# Altium project PCB_Project.PrjPcb (part 1 of 2)
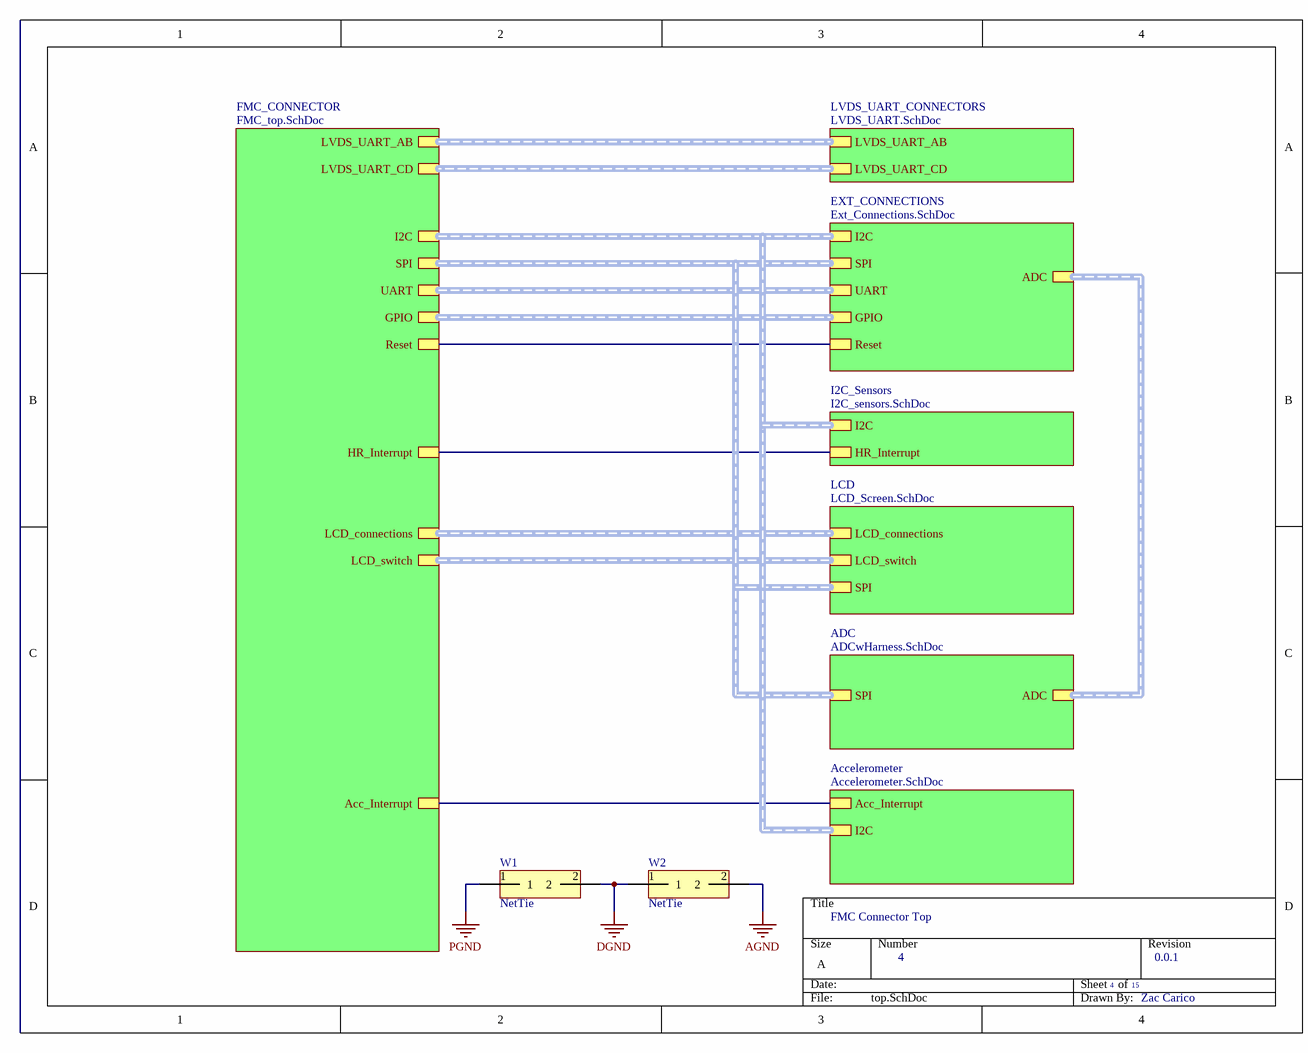
[diagram p0: top.SchDoc]
15 sheets, 131 parts. Net scope: hierarchical (ports join the sheet entries above them; power ports are global).
Board file: PCB1.PcbDoc
Sheets:
  top.SchDoc
    FMC_CONNECTOR = FMC_top.SchDoc
      FMC_AB = FMC_connector_AB.SchDoc
      FMC_CD = FMC_connector_CD.SchDoc
      FMC_EF = FMC_connector_EF.SchDoc
      FMC_GH = FMC_connector_GH.SchDoc
      FMC_JK = FMC_connector_JK.SchDoc
    LVDS_UART_CONNECTORS = LVDS_UART.SchDoc
    EXT_CONNECTIONS = Ext_connections.SchDoc
      Designator = GPIO_SW.SchDoc
      Designator = GPIO_LED.SchDoc
    I2C_Sensors = I2C_sensors.SchDoc
    LCD = LCD_Screen.SchDoc
    ADC = ADCwHarness.SchDoc
    Accelerometer = Accelerometer.SchDoc

## Sheet top.SchDoc: FMC Connector Top
size A; Author: Zac Carico; CompanyName: BYUI; DrawnBy: Zac Carico; Engineer: Zac Carico; Organization: CSEE; DocumentNumber: 4; Revision: 0.0.1; SheetNumber: 4; SheetTotal: 15

### Parts
W1  NetTie  [NetTie]  (net tie, no BOM)
W2  NetTie  [NetTie]  (net tie, no BOM)

### Sub-sheets
Accelerometer = Accelerometer.SchDoc: Acc_Interrupt, I2C (harness I2C)
ADC = ADCwHarness.SchDoc: ADC (harness ADC), SPI (harness SPI)
EXT_CONNECTIONS = Ext_Connections.SchDoc: I2C (harness I2C), SPI (harness SPI), UART (harness UART), GPIO (harness GPIO), ADC (harness ADC), Reset
FMC_CONNECTOR = FMC_top.SchDoc: GPIO (harness GPIO), UART (harness UART), I2C (harness I2C), SPI (harness SPI), LCD_connections (harness LCD_connections), LCD_switch (harness LCD_switch), Acc_Interrupt, LVDS_UART_AB (harness LVDS_UART_AB), LVDS_UART_CD (harness LVDS_UART_CD), Reset, HR_Interrupt
I2C_Sensors = I2C_sensors.SchDoc: I2C (harness I2C), HR_Interrupt
LCD = LCD_Screen.SchDoc: LCD_connections (harness LCD_connections), LCD_switch (harness LCD_switch), SPI (harness SPI)
LVDS_UART_CONNECTORS = LVDS_UART.SchDoc: LVDS_UART_CD (harness LVDS_UART_CD), LVDS_UART_AB (harness LVDS_UART_AB)

### Nets
AGND: W2.2
DGND: W1.2 W2.1
PGND: W1.1
NetJ1_F19: sheet FMC_CONNECTOR/Acc_Interrupt, sheet Accelerometer/Acc_Interrupt
NetJ1_F20: sheet FMC_CONNECTOR/Reset, sheet EXT_CONNECTIONS/Reset
NetJ1_F37: sheet FMC_CONNECTOR/HR_Interrupt, sheet I2C_Sensors/HR_Interrupt

### Buses and harness runs
harness sheet Accelerometer/I2C = sheet EXT_CONNECTIONS/I2C = sheet FMC_CONNECTOR/I2C = sheet I2C_Sensors/I2C
harness sheet ADC/ADC = sheet EXT_CONNECTIONS/ADC
harness sheet ADC/SPI = sheet EXT_CONNECTIONS/SPI = sheet FMC_CONNECTOR/LCD_switch = sheet FMC_CONNECTOR/SPI = sheet LCD/LCD_switch = sheet LCD/SPI
harness sheet EXT_CONNECTIONS/GPIO = sheet FMC_CONNECTOR/GPIO
harness sheet EXT_CONNECTIONS/UART = sheet FMC_CONNECTOR/UART
harness sheet FMC_CONNECTOR/LCD_connections = sheet LCD/LCD_connections
harness sheet FMC_CONNECTOR/LVDS_UART_AB = sheet LVDS_UART_CONNECTORS/LVDS_UART_AB
harness sheet FMC_CONNECTOR/LVDS_UART_CD = sheet LVDS_UART_CONNECTORS/LVDS_UART_CD

## Sheet FMC_top.SchDoc: FMC Connector Top
size A; Author: James Thomas; CompanyName: BYUI; DrawnBy: James Thomas; Engineer: James Thomas; Organization: CSEE; DocumentNumber: 8; Revision: 0.0.1; SheetNumber: 8; SheetTotal: 15
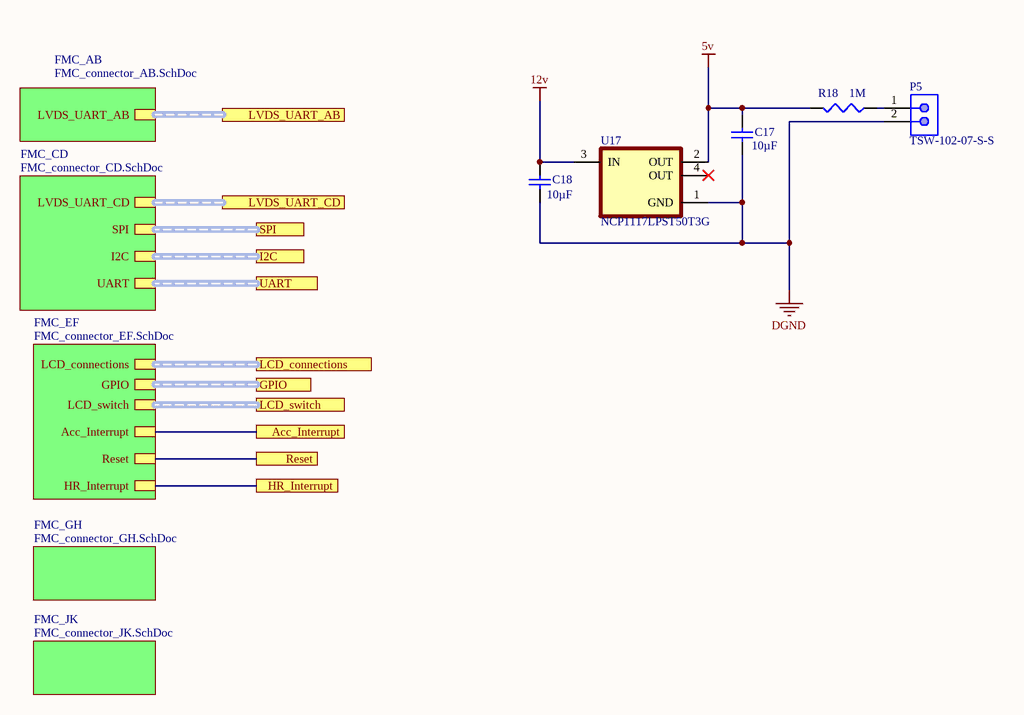
[diagram p1: FMC_top.SchDoc]

### Parts
C17  Capacitance: 10µF  [CAPC1608X90X20LL10]  (hidden comment: C1608X5R1A106K080AC)
C18  Capacitance: 10µF  [CAPC1608X90X20LL10]  (hidden comment: C1608X5R1A106K080AC)
P5  TSW-102-07-S-S  [SMTC-TSW-102-07-S-S]
R18  value 1M  [J1-0603]  (hidden comment: Res3)
U17  NCP1117LPST50T3G  [SOT230P700X180-4N]

### Sub-sheets
FMC_AB = FMC_connector_AB.SchDoc: LVDS_UART_AB (harness LVDS_UART_AB)
FMC_CD = FMC_connector_CD.SchDoc: LVDS_UART_CD (harness LVDS_UART_CD), I2C (harness I2C), SPI (harness SPI), UART (harness UART)
FMC_EF = FMC_connector_EF.SchDoc: LCD_connections (harness LCD_connections), GPIO (harness GPIO), LCD_switch (harness LCD_switch), Acc_Interrupt, Reset, HR_Interrupt
FMC_GH = FMC_connector_GH.SchDoc: no entries
FMC_JK = FMC_connector_JK.SchDoc: no entries

### Ports
Acc_Interrupt, GPIO (harness GPIO), HR_Interrupt, I2C (harness I2C), LCD_connections (harness LCD_connections), LCD_switch (harness LCD_switch), LVDS_UART_AB, LVDS_UART_CD, Reset, SPI (harness SPI), UART (harness UART)

### Nets
5v: C17.2 R18.2 U17.2(OUT)
12v: C18.2 U17.3(IN)
DGND: C17.1 C18.1 P5.2 U17.1(GND)
NetJ1_F19: port Acc_Interrupt, sheet FMC_EF/Acc_Interrupt
NetJ1_F20: port Reset, sheet FMC_EF/Reset
NetJ1_F37: port HR_Interrupt, sheet FMC_EF/HR_Interrupt
NetP5_1: P5.1 R18.1

Not connected (* = marked no-connect by the designer): U17 4(OUT)*

### Buses and harness runs
harness port GPIO = sheet FMC_EF/GPIO
harness port I2C = sheet FMC_CD/I2C
harness port LCD_connections = sheet FMC_EF/LCD_connections
harness port LCD_switch = sheet FMC_EF/LCD_switch
harness port LVDS_UART_AB = sheet FMC_AB/LVDS_UART_AB
harness port LVDS_UART_CD = sheet FMC_CD/LVDS_UART_CD
harness port SPI = sheet FMC_CD/SPI
harness port UART = sheet FMC_CD/UART

### Library data of the parts
C17 C18 = CMP-2000-04979-1: Chip Capacitor, 10 uF, +/- 10%, 10 V, -55 to 85 degC, 0603 (1608 Metric), RoHS, Tape and Reel; PCN Part Number: MLCCPartNumberChange30/Nov/2012; Manufacturer: TDK; Temperature Coefficient: X5R; Product Training Modules: CSeriesGeneralApplicationsSEAT,CCV,andTVCLDesignToolsGuidetoReplacinganElectrolyticCapacitorwithanMLCC; Online Catalog: CSeries,GeneralPurpose; Voltage - Rated: 10V; Other Names: 445-7486-1; Design Resources: 20WNon-IsolatedBuckLEDDriverUsingPLLNK460KG; Kits: 445-9003-KIT-ND-KITCAPCERHICAPMLCCSMD; Height - Seated (Max): -; Family: CeramicCapacitors; Package Description: 2-Pin Surface Mount Device, Body 1.6 x 0.8 mm; Category: Capacitors; Datasheet Version: Mar-15; RoHS Information: RoHSCertificate-MLCC; Thickness (Max): 0.035"(0.90mm); Operating Temperature: -55degC~85degC; Package Reference: 603; Series: C; Applications: GeneralPurpose; Datasheet URL: http://download.siliconexpert.com/pdfs/2015/4/21/15/54/45/779/tdk_/manual/37024850441143360mlcc_commercial_general_en.pdf; Features: -; Lead Style: -; Lead Spacing: -; Ratings: -; Size / Dimension: 0.063"Lx0.031"W(1.60mmx0.80mm); Tolerance: ±10%; Mounting Type: SurfaceMount,MLCC; Standard Package: 1; Package / Case: 0603(1608Metric); Manufacturer URL: http://www.tdk.com/; Packaging: CutTape(CT); Manufacturer Part Number: C1608X5R1A106K080AC
P5 = CMP-1681-00004-4: Male Header, Pitch 2.54 mm, 1 x 2 Position, Height 8.38 mm, Tail Length 2.54 mm, -55 to 125 degC, RoHS, Bulk; Manufacturer: Samtec; Rows: 1; ComponentLink1URL: http://www.samtec.com/; Contact Finish: Gold; Mounting Technology: Through Hole; PackageReference: TSW-102-07-S-S; RoHSCompliant: true; Pins: 2; Contact Material: Bronze; ComponentLink2Description: Datasheet; Max Operating Temperature: 125 degC; Min Operating Temperature: -55 degC; Height: 8.38 mm; Packaging: Bulk; ComponentLink1Description: Manufacturer URL; PackageDescription: Male Header, Pitch 2.54 mm, 1 x 2 Position, Height 8.38 mm, Tail Length 2.54 mm; Colour: Black; Contact Plating: Gold; Length: 5.08 mm; ComponentLink2URL: http://suddendocs.samtec.com/catalog_english/tsw_th.pdf; DatasheetVersion: 12/2015; Mount: Through Hole; Lead Pitch: 0.1 inch; REACH SVHC: No SVHC; Package Quantity: 1
R18 = Res3: Resistor; Published: 8-Jun-2000; LatestRevisionDate: 29-May-2009; LatestRevisionNote: IPC-7351 Footprint Added.; PackageReference: J1-0603; Publisher: Altium Limited; PackageDescription: Chip Resistor
U17 = NCP1117LPST50T3G: Linear Voltage Regulator IC 1 Output 1A SOT-223; MF: ON Semiconductor; Digi-Key_Purchase_URL: https://www.digikey.com/product-detail/en/on-semiconductor/NCP1117LPST50T3G/NCP1117LPST50T3GOSCT-ND/5801728?utm_source=snapeda&utm_medium=aggregator&utm_campaign=symbol; MP: NCP1117LPST50T3G; Package: SOT-223 ON Semiconductor; SnapEDA_Link: https://www.snapeda.com/parts/NCP1117LPST50T3G/ON%20Semiconductor/view-part/451805/?ref=snap; Value: *; Digi-Key_Part_Number: NCP1117LPST50T3GOSCT-ND

## Sheet FMC_connector_AB.SchDoc: FMC Connector AB
size A; Author: James Thomas; CompanyName: BYUI; DrawnBy: James Thomas; Engineer: James Thomas; Organization: CSEE; DocumentNumber: 6; Revision: 0.0.1; SheetNumber: 6; SheetTotal: 15
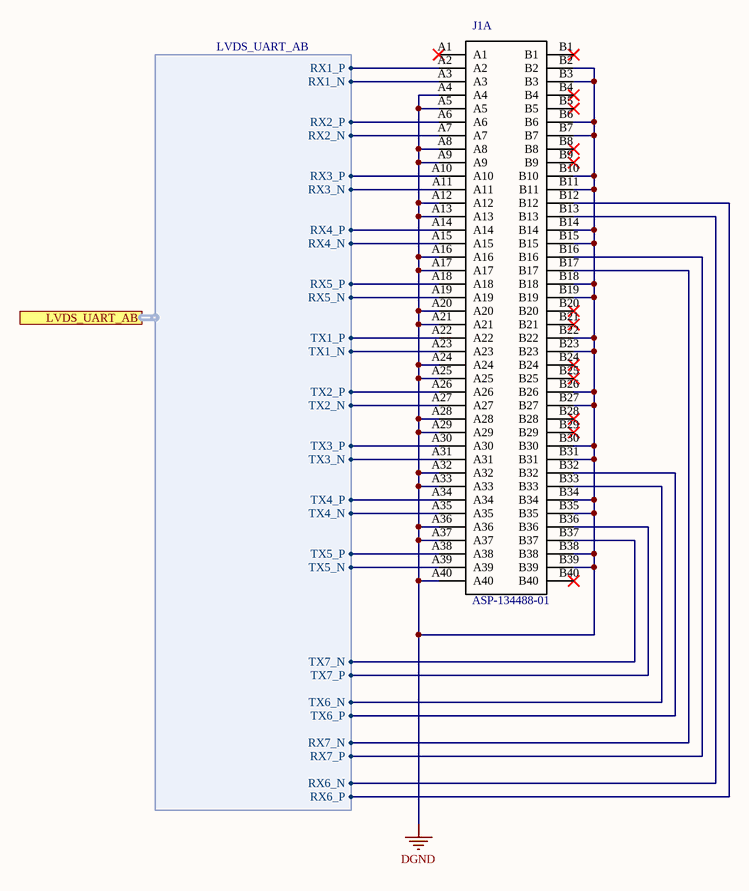
[diagram p2: FMC_connector_AB.SchDoc]

### Parts
J1  ASP-134488-01  [*SAMTEC_ASP-134488-01_ASP-134488-01(Primary)]  (part A of 5)

### Ports
LVDS_UART_AB (harness LVDS_UART_AB)

### Harnesses
LVDS_UART_AB: RX1_P, RX1_N, RX2_P, RX2_N, RX3_P, RX3_N, RX4_P, RX4_N, RX5_P, RX5_N, TX1_P, TX1_N, TX2_P, TX2_N, TX3_P, TX3_N, TX4_P, TX4_N, TX5_P, TX5_N, TX6_P, TX6_N, TX7_P, TX7_N, RX7_P, RX7_N, RX6_P, RX6_N

### Nets
DGND: J1.A4 J1.A5 J1.A8 J1.A9 J1.A12 J1.A13 J1.A16 J1.A17 J1.A20 J1.A21 J1.A24 J1.A25 J1.A28 J1.A29 J1.A32 J1.A33 J1.A36 J1.A37 J1.A40 J1.B2 J1.B3 J1.B6 J1.B7 J1.B10 J1.B11 J1.B14 J1.B15 J1.B18 J1.B19 J1.B22 J1.B23 J1.B26 J1.B27 J1.B30 J1.B31 J1.B34 J1.B35 J1.B38 J1.B39
NetJ1_A2: J1.A2 ; port LVDS_UART_AB.RX1_P
NetJ1_A3: J1.A3 ; port LVDS_UART_AB.RX1_N
NetJ1_A6: J1.A6 ; port LVDS_UART_AB.RX2_P
NetJ1_A7: J1.A7 ; port LVDS_UART_AB.RX2_N
NetJ1_A10: J1.A10 ; port LVDS_UART_AB.RX3_P
NetJ1_A11: J1.A11 ; port LVDS_UART_AB.RX3_N
NetJ1_A14: J1.A14 ; port LVDS_UART_AB.RX4_P
NetJ1_A15: J1.A15 ; port LVDS_UART_AB.RX4_N
NetJ1_A18: J1.A18 ; port LVDS_UART_AB.RX5_P
NetJ1_A19: J1.A19 ; port LVDS_UART_AB.RX5_N
NetJ1_A22: J1.A22 ; port LVDS_UART_AB.TX1_P
NetJ1_A23: J1.A23 ; port LVDS_UART_AB.TX1_N
NetJ1_A26: J1.A26 ; port LVDS_UART_AB.TX2_P
NetJ1_A27: J1.A27 ; port LVDS_UART_AB.TX2_N
NetJ1_A30: J1.A30 ; port LVDS_UART_AB.TX3_P
NetJ1_A31: J1.A31 ; port LVDS_UART_AB.TX3_N
NetJ1_A34: J1.A34 ; port LVDS_UART_AB.TX4_P
NetJ1_A35: J1.A35 ; port LVDS_UART_AB.TX4_N
NetJ1_A38: J1.A38 ; port LVDS_UART_AB.TX5_P
NetJ1_A39: J1.A39 ; port LVDS_UART_AB.TX5_N
NetJ1_B12: J1.B12 ; port LVDS_UART_AB.RX6_P
NetJ1_B13: J1.B13 ; port LVDS_UART_AB.RX6_N
NetJ1_B16: J1.B16 ; port LVDS_UART_AB.RX7_P
NetJ1_B17: J1.B17 ; port LVDS_UART_AB.RX7_N
NetJ1_B32: J1.B32 ; port LVDS_UART_AB.TX6_P
NetJ1_B33: J1.B33 ; port LVDS_UART_AB.TX6_N
NetJ1_B36: J1.B36 ; port LVDS_UART_AB.TX7_P
NetJ1_B37: J1.B37 ; port LVDS_UART_AB.TX7_N

Not connected (* = marked no-connect by the designer): J1 A1* B1* B4* B5* B8* B9* B20* B21* B24* B25* B28* B29* B40*

### Library data of the parts
J1 = ASP-134488-01: SnapEDA_Link: https://www.snapeda.com/parts/ASP-134488-01/Samtec%20Inc./view-part/423215/?ref=snap; Value: *

## Sheet FMC_connector_CD.SchDoc: FMC Connector CD
size A; Author: James Thomas; CompanyName: BYUI; DrawnBy: James Thomas; Engineer: James Thomas; Organization: CSEE; DocumentNumber: 5; Revision: 0.0.1; SheetNumber: 5; SheetTotal: 15
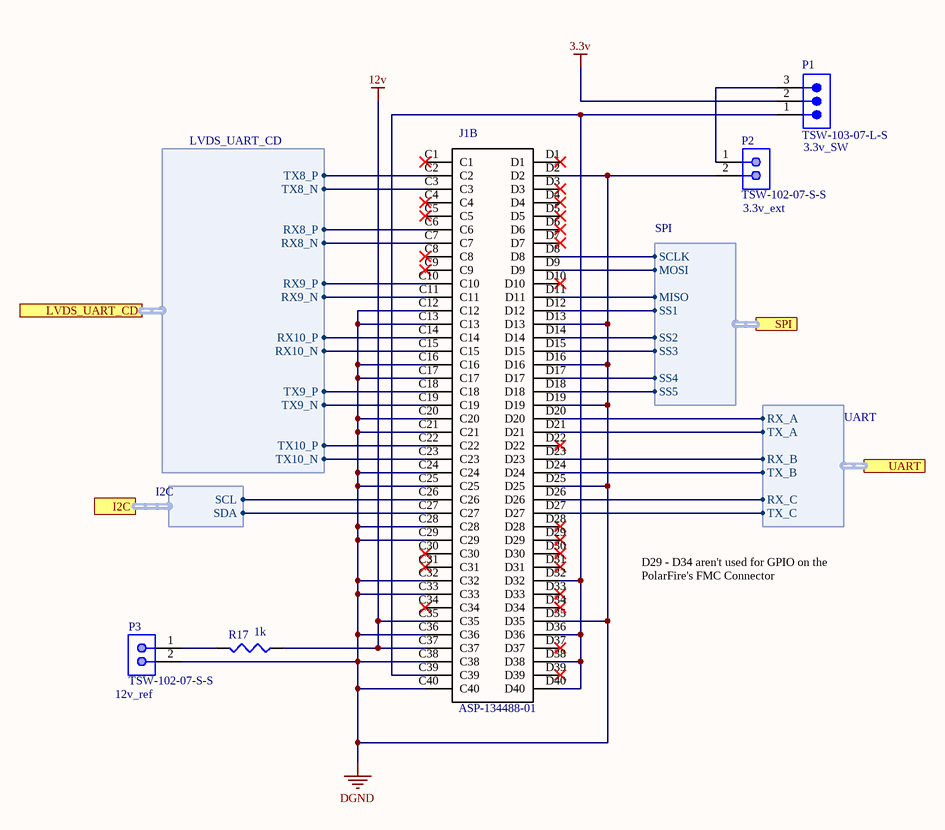
[diagram p3: FMC_connector_CD.SchDoc]

### Parts
J1  ASP-134488-01  [*SAMTEC_ASP-134488-01_ASP-134488-01(Primary)]  (part B of 5)
P1  TSW-103-07-L-S  [SMTC-TSW-103-07-X-S]
P2  TSW-102-07-S-S  [SMTC-TSW-102-07-S-S]
P3  TSW-102-07-S-S  [SMTC-TSW-102-07-S-S]
R17  value 1k  [J1-0603]  (hidden comment: Res3)

### Ports
I2C (harness I2C), LVDS_UART_CD (harness LVDS_UART_CD), SPI (harness SPI), UART (harness UART)

### Harnesses
I2C: SCL, SDA
SPI: SS1, SS2, MOSI, MISO, SCLK, SS3, SS4, SS5
UART: RX_A, TX_A, RX_B, TX_B, RX_C, TX_C
LVDS_UART_CD: TX8_P, TX8_N, RX8_P, RX8_N, RX9_N, RX9_P, TX10_P, TX10_N, TX9_P, TX9_N, RX10_P, RX10_N

### Nets
3.3v: P1.2
12v: J1.C35 J1.C37 R17.1
DGND: J1.C12 J1.C13 J1.C16 J1.C17 J1.C20 J1.C21 J1.C24 J1.C25 J1.C28 J1.C29 J1.C32 J1.C33 J1.C36 J1.C38 J1.C40 J1.D2 J1.D13 J1.D16 J1.D19 J1.D25 J1.D35 P2.2 P3.2
NetJ1_C2: J1.C2 ; port LVDS_UART_CD.TX8_P
NetJ1_C3: J1.C3 ; port LVDS_UART_CD.TX8_N
NetJ1_C6: J1.C6 ; port LVDS_UART_CD.RX8_P
NetJ1_C7: J1.C7 ; port LVDS_UART_CD.RX8_N
NetJ1_C10: J1.C10 ; port LVDS_UART_CD.RX9_P
NetJ1_C11: J1.C11 ; port LVDS_UART_CD.RX9_N
NetJ1_C14: J1.C14 ; port LVDS_UART_CD.RX10_P
NetJ1_C15: J1.C15 ; port LVDS_UART_CD.RX10_N
NetJ1_C18: J1.C18 ; port LVDS_UART_CD.TX9_P
NetJ1_C19: J1.C19 ; port LVDS_UART_CD.TX9_N
NetJ1_C22: J1.C22 ; port LVDS_UART_CD.TX10_P
NetJ1_C23: J1.C23 ; port LVDS_UART_CD.TX10_N
NetJ1_C26: J1.C26 ; port I2C.SCL
NetJ1_C27: J1.C27 ; port I2C.SDA
NetJ1_C39: J1.C39 J1.D32 J1.D36 J1.D38 J1.D40 P1.1
NetJ1_D8: J1.D8 ; port SPI.SCLK
NetJ1_D9: J1.D9 ; port SPI.MOSI
NetJ1_D11: J1.D11 ; port SPI.MISO
NetJ1_D12: J1.D12 ; port SPI.SS1
NetJ1_D14: J1.D14 ; port SPI.SS2
NetJ1_D15: J1.D15 ; port SPI.SS3
NetJ1_D17: J1.D17 ; port SPI.SS4
NetJ1_D18: J1.D18 ; port SPI.SS5
NetJ1_D20: J1.D20 ; port UART.RX_A
NetJ1_D21: J1.D21 ; port UART.TX_A
NetJ1_D23: J1.D23 ; port UART.RX_B
NetJ1_D24: J1.D24 ; port UART.TX_B
NetJ1_D26: J1.D26 ; port UART.RX_C
NetJ1_D27: J1.D27 ; port UART.TX_C
NetP1_3: P1.3 P2.1
NetP3_1: P3.1 R17.2

Not connected (* = marked no-connect by the designer): J1 C1* C4* C5* C8* C9* C30* C31* C34* D1* D3* D4* D5* D6* D7* D10* D22* D28* D29* D30* D31* D33* D34* D37* D39*

### Notes on the sheet
- (near P2) 3.3v_ext
- (near P1) 3.3v_SW
- D29 - D34 aren't used for GPIO on the PolarFire's FMC Connector
- (near P3) 12v_ref

### Library data of the parts
J1 = ASP-134488-01: Male FMC HPC Connector; SnapEDA_Link: https://www.snapeda.com/parts/ASP-134488-01/Samtec%20Inc./view-part/423215/?ref=snap; Value: *
P1 = CMP-1024-00334-1: 0.025" SQ Post Header, Through-hole, Vertical, -55 to 125 degC, 2.54 mm Pitch, 3-Pin, Male, RoHS; Manufacturer: Samtec; Pitch: 2.54 mm; Mounting Technology: Through-hole; ComponentLink2URL: http://www.samtec.com/documents/webfiles/pdf/TSW_TH.PDF; ComponentLink3Description: Package Specification; PackageVersion: DM, 8/1988; PartNumber: TSW-103-07-L-S; PackageReference: TSW-103-07-X-S; Orientation: Vertical; ComponentLink1URL: http://www.samtec.com; PackageDescription: .025[0.64] SQ. Post Terminal Strip Assembly; ComponentLink1Description: Manufacturer URL; ComponentLink2Description: Datasheet; ComponentLink3URL: http://www.samtec.com/documents/webfiles/cpdf/TSW-XXX-XX-XXX-X-XX-XXX-MKT.pdf; RoHS: True; DatasheetVersion: F-214; Temperature Range: -55 to 125 degC
P2 P3 = CMP-1681-00004-4: as P5 on sheet FMC_top; ComponentLink1URL: http://www.samtec.com/; Contact Finish: Gold; Mounting Technology: Through Hole; PackageReference: TSW-102-07-S-S; RoHSCompliant: true; Pins: 2; Contact Material: Bronze; ComponentLink2Description: Datasheet; Max Operating Temperature: 125 degC; Min Operating Temperature: -55 degC; Height: 8.38 mm; Packaging: Bulk; ComponentLink1Description: Manufacturer URL; PackageDescription: Male Header, Pitch 2.54 mm, 1 x 2 Position, Height 8.38 mm, Tail Length 2.54 mm; Colour: Black; Contact Plating: Gold; Length: 5.08 mm; ComponentLink2URL: http://suddendocs.samtec.com/catalog_english/tsw_th.pdf; DatasheetVersion: 12/2015; Mount: Through Hole; Lead Pitch: 0.1 inch; REACH SVHC: No SVHC; Package Quantity: 1
R17 = Res3: Resistor; Published: 8-Jun-2000; LatestRevisionDate: 29-May-2009; LatestRevisionNote: IPC-7351 Footprint Added.; PackageReference: J1-0603; Publisher: Altium Limited; PackageDescription: Chip Resistor

## Sheet FMC_connector_EF.SchDoc: FMC Connector EF
size A; Author: James Thomas; CompanyName: BYUI; DrawnBy: James Thomas; Engineer: James Thomas; Organization: CSEE; DocumentNumber: 7; Revision: 0.0.1; SheetNumber: 7; SheetTotal: 15
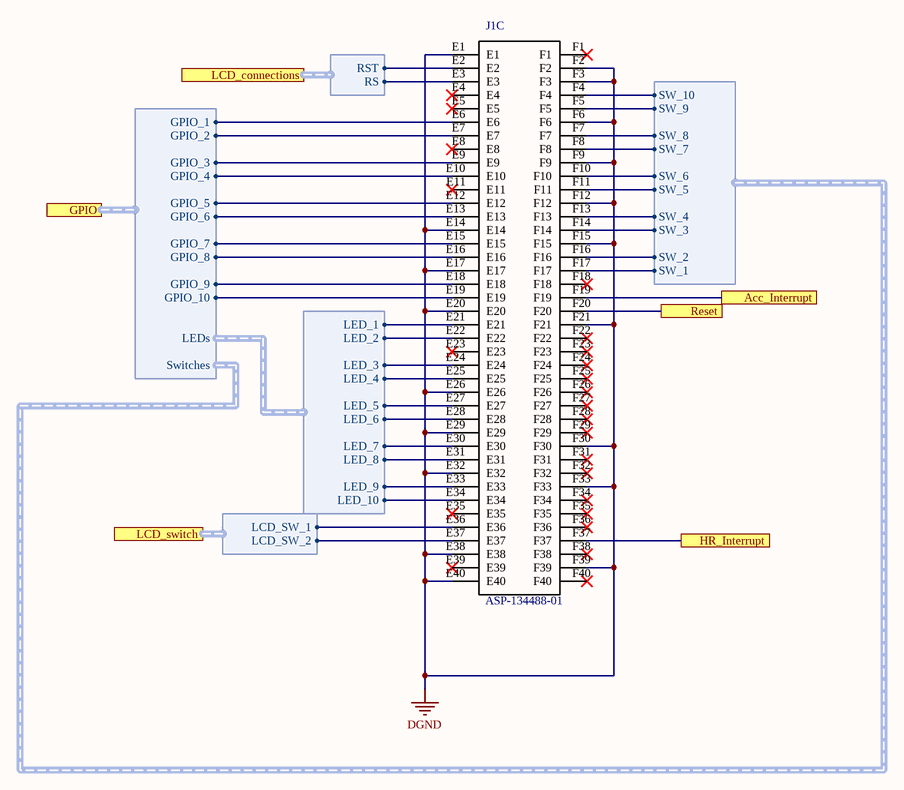
[diagram p4: FMC_connector_EF.SchDoc]

### Parts
J1  ASP-134488-01  [*SAMTEC_ASP-134488-01_ASP-134488-01(Primary)]  (part C of 5)

### Ports
Acc_Interrupt, GPIO (harness GPIO), HR_Interrupt, LCD_connections (harness LCD_connections), LCD_switch (harness LCD_switch), Reset

### Harnesses
LCD_connections: RST, RS
GPIO: GPIO_1, GPIO_2, GPIO_3, GPIO_4, GPIO_5, GPIO_6, GPIO_7, GPIO_8, GPIO_9, GPIO_10, LEDs, Switches
LED: LED_1, LED_2, LED_3, LED_4, LED_5, LED_6, LED_7, LED_8, LED_9, LED_10
SW: SW_10, SW_9, SW_8, SW_7, SW_6, SW_5, SW_4, SW_3, SW_2, SW_1
LCD_switch: LCD_SW_1, LCD_SW_2

### Nets
DGND: J1.E1 J1.E14 J1.E17 J1.E20 J1.E26 J1.E29 J1.E32 J1.E38 J1.E40 J1.F2 J1.F3 J1.F6 J1.F9 J1.F12 J1.F15 J1.F21 J1.F30 J1.F33 J1.F39
NetJ1_E2: J1.E2 ; port LCD_connections.RST
NetJ1_E3: J1.E3 ; port LCD_connections.RS
NetJ1_E6: J1.E6 ; port GPIO.GPIO_1
NetJ1_E7: J1.E7 ; port GPIO.GPIO_2
NetJ1_E9: J1.E9 ; port GPIO.GPIO_3
NetJ1_E10: J1.E10 ; port GPIO.GPIO_4
NetJ1_E12: J1.E12 ; port GPIO.GPIO_5
NetJ1_E13: J1.E13 ; port GPIO.GPIO_6
NetJ1_E15: J1.E15 ; port GPIO.GPIO_7
NetJ1_E16: J1.E16 ; port GPIO.GPIO_8
NetJ1_E18: J1.E18 ; port GPIO.GPIO_9
NetJ1_E19: J1.E19 ; port GPIO.GPIO_10
NetJ1_E21: J1.E21 ; harness LED.LED_1
NetJ1_E22: J1.E22 ; harness LED.LED_2
NetJ1_E24: J1.E24 ; harness LED.LED_3
NetJ1_E25: J1.E25 ; harness LED.LED_4
NetJ1_E27: J1.E27 ; harness LED.LED_5
NetJ1_E28: J1.E28 ; harness LED.LED_6
NetJ1_E30: J1.E30 ; harness LED.LED_7
NetJ1_E31: J1.E31 ; harness LED.LED_8
NetJ1_E33: J1.E33 ; harness LED.LED_9
NetJ1_E34: J1.E34 ; harness LED.LED_10
NetJ1_E36: J1.E36 ; port LCD_switch.LCD_SW_1
NetJ1_E37: J1.E37 ; port LCD_switch.LCD_SW_2
NetJ1_F4: J1.F4 ; harness SW.SW_10
NetJ1_F5: J1.F5 ; harness SW.SW_9
NetJ1_F7: J1.F7 ; harness SW.SW_8
NetJ1_F8: J1.F8 ; harness SW.SW_7
NetJ1_F10: J1.F10 ; harness SW.SW_6
NetJ1_F11: J1.F11 ; harness SW.SW_5
NetJ1_F13: J1.F13 ; harness SW.SW_4
NetJ1_F14: J1.F14 ; harness SW.SW_3
NetJ1_F16: J1.F16 ; harness SW.SW_2
NetJ1_F17: J1.F17 ; harness SW.SW_1
NetJ1_F19: J1.F19 ; port Acc_Interrupt
NetJ1_F20: J1.F20 ; port Reset
NetJ1_F37: J1.F37 ; port HR_Interrupt

Not connected (* = marked no-connect by the designer): J1 E4* E5* E8* E11* E23* E35* E39* F1* F18* F22* F23* F24* F25* F26* F27* F28* F29* F31* F32* F34* F35* F36* F38* F40*

### Library data of the parts
J1 = ASP-134488-01: SnapEDA_Link: https://www.snapeda.com/parts/ASP-134488-01/Samtec%20Inc./view-part/423215/?ref=snap; Value: *

## Sheet FMC_connector_GH.SchDoc: FMC Connector GH
size A; Author: James Thomas; CompanyName: BYUI; DrawnBy: James Thomas; Engineer: James Thomas; Organization: CSEE; DocumentNumber: 13; Revision: 0.0.1; SheetNumber: 13; SheetTotal: 15
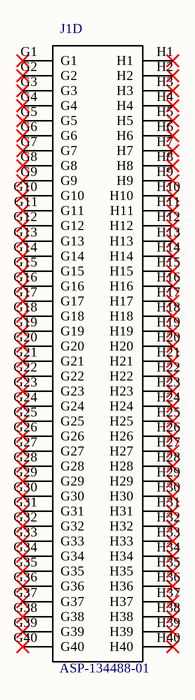
[diagram p5: FMC_connector_GH.SchDoc]

### Parts
J1  ASP-134488-01  [*SAMTEC_ASP-134488-01_ASP-134488-01(Primary)]  (part D of 5)

### Nets

Not connected (* = marked no-connect by the designer): J1 G1* G2* G3* G4* G5* G6* G7* G8* G9* G10* G11* G12* G13* G14* G15* G16* G17* G18* G19* G20* G21* G22* G23* G24* G25* G26* G27* G28* G29* G30* G31* G32* G33* G34* G35* G36* G37* G38* G39* G40* H1* H2* H3* H4* H5* H6* H7* H8* H9* H10* H11* H12* H13* H14* H15* H16* H17* H18* H19* H20* H21* H22* H23* H24* H25* H26* H27* H28* H29* H30* H31* H32* H33* H34* H35* H36* H37* H38* H39* H40*

### Library data of the parts
J1 = ASP-134488-01: SnapEDA_Link: https://www.snapeda.com/parts/ASP-134488-01/Samtec%20Inc./view-part/423215/?ref=snap; Value: *

## Sheet FMC_connector_JK.SchDoc: FMC Connector JK
size A; Author: James Thomas; CompanyName: BYUI; DrawnBy: James Thomas; Engineer: James Thomas; Organization: CSEE; DocumentNumber: 14; Revision: 0.0.1; SheetNumber: 14; SheetTotal: 15
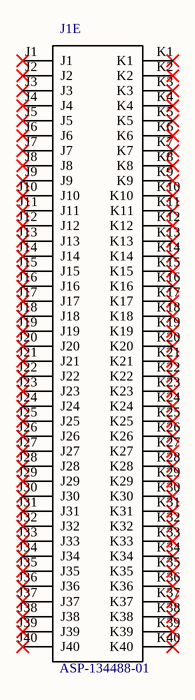
[diagram p6: FMC_connector_JK.SchDoc]

### Parts
J1  ASP-134488-01  [*SAMTEC_ASP-134488-01_ASP-134488-01(Primary)]  (part E of 5)

### Nets

Not connected (* = marked no-connect by the designer): J1 J1* J2* J3* J4* J5* J6* J7* J8* J9* J10* J11* J12* J13* J14* J15* J16* J17* J18* J19* J20* J21* J22* J23* J24* J25* J26* J27* J28* J29* J30* J31* J32* J33* J34* J35* J36* J37* J38* J39* J40* K1* K2* K3* K4* K5* K6* K7* K8* K9* K10* K11* K12* K13* K14* K15* K16* K17* K18* K19* K20* K21* K22* K23* K24* K25* K26* K27* K28* K29* K30* K31* K32* K33* K34* K35* K36* K37* K38* K39* K40*

### Library data of the parts
J1 = ASP-134488-01: SnapEDA_Link: https://www.snapeda.com/parts/ASP-134488-01/Samtec%20Inc./view-part/423215/?ref=snap; Value: *

## Sheet LVDS_UART.SchDoc: LVDS UART
size A; Author: James Thomas; CompanyName: BYUI; DrawnBy: James Thomas; Engineer: James Thomas; Organization: CSEE; DocumentNumber: 2; Revision: 0.0.1; SheetNumber: 2; SheetTotal: 15
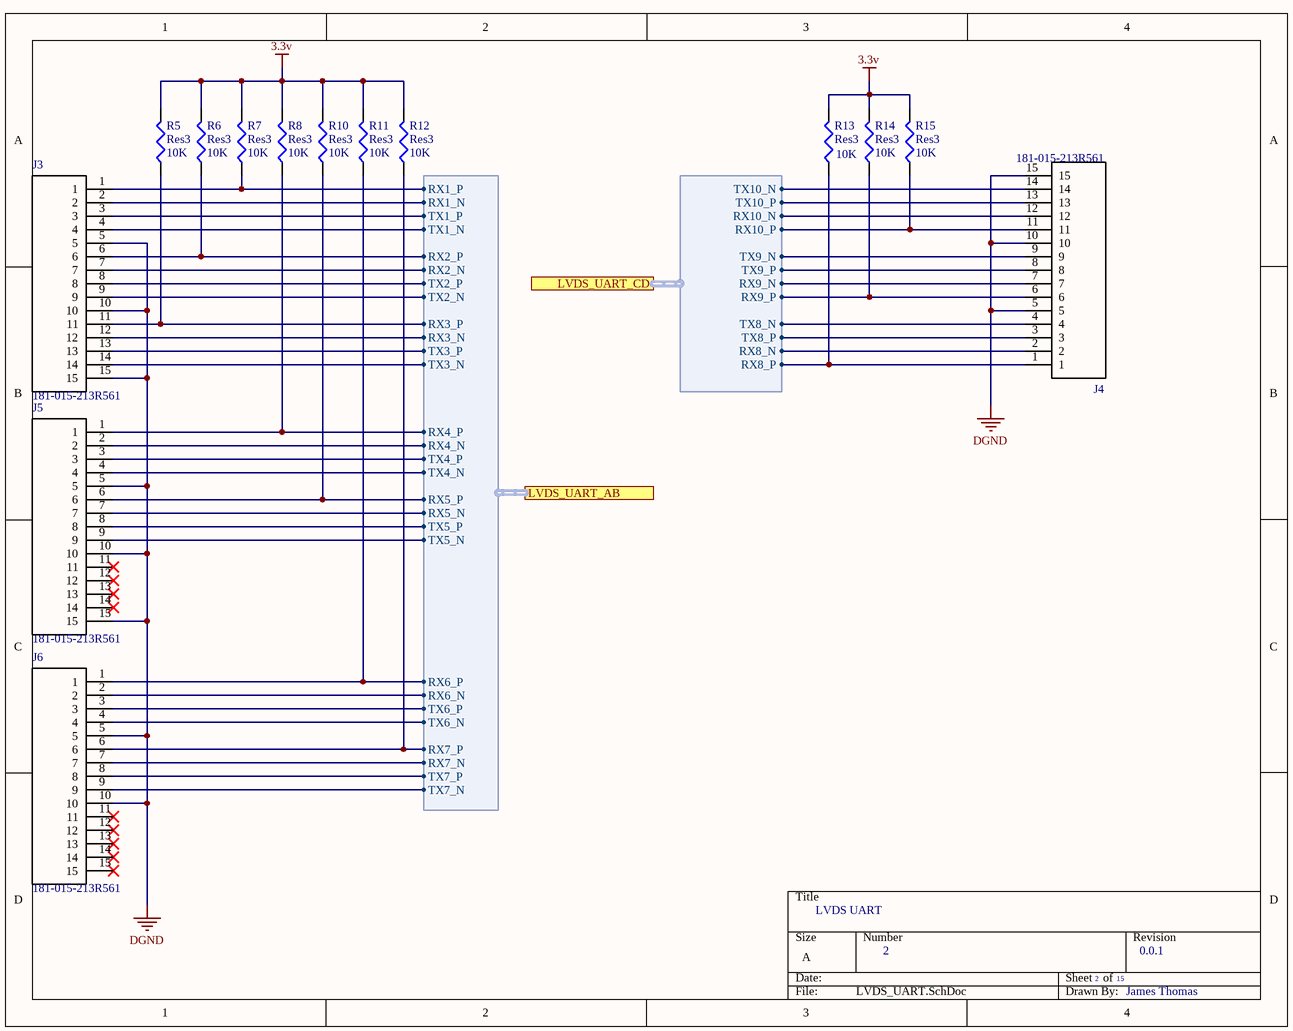
[diagram p7: LVDS_UART.SchDoc]

### Parts
J3  181-015-213R561  [*NORCOMP_181-015-213R561]
J4  181-015-213R561  [*NORCOMP_181-015-213R561]
J5  181-015-213R561  [*NORCOMP_181-015-213R561]
J6  181-015-213R561  [*NORCOMP_181-015-213R561]
R5  Res3  value 10K  [J1-0603]
R6  Res3  value 10K  [J1-0603]
R7  Res3  value 10K  [J1-0603]
R8  Res3  value 10K  [J1-0603]
R10  Res3  value 10K  [J1-0603]
R11  Res3  value 10K  [J1-0603]
R12  Res3  value 10K  [J1-0603]
R13  Res3  value 10K  [J1-0603]
R14  Res3  value 10K  [J1-0603]
R15  Res3  value 10K  [J1-0603]

### Ports
LVDS_UART_AB (harness LVDS_UART_AB), LVDS_UART_CD (harness LVDS_UART_CD)

### Harnesses
LVDS_UART_AB: RX1_P, RX1_N, TX1_P, TX1_N, RX2_P, RX2_N, TX2_P, TX2_N, RX3_P, RX3_N, TX3_P, TX3_N, RX4_P, RX4_N, TX4_P, TX4_N, RX5_P, RX5_N, TX5_P, TX5_N, RX6_P, RX6_N, TX6_P, TX6_N, RX7_P, RX7_N, TX7_P, TX7_N
LVDS_UART_CD: RX8_P, RX8_N, TX8_P, TX8_N, RX9_P, RX9_N, TX9_P, TX9_N, RX10_P, RX10_N, TX10_P, TX10_N

### Nets
3.3v: R5.2 R6.2 R7.2 R8.2 R10.2 R11.2 R12.2 R13.2 R14.2 R15.2
DGND: J3.5 J3.10 J3.15 J4.5 J4.10 J4.15 J5.5 J5.10 J5.15 J6.5 J6.10
NetJ1_A2: J3.1 R7.1 ; port LVDS_UART_AB.RX1_P
NetJ1_A3: J3.2 ; port LVDS_UART_AB.RX1_N
NetJ1_A6: J3.6 R6.1 ; port LVDS_UART_AB.RX2_P
NetJ1_A7: J3.7 ; port LVDS_UART_AB.RX2_N
NetJ1_A10: J3.11 R5.1 ; port LVDS_UART_AB.RX3_P
NetJ1_A11: J3.12 ; port LVDS_UART_AB.RX3_N
NetJ1_A14: J5.1 R8.1 ; port LVDS_UART_AB.RX4_P
NetJ1_A15: J5.2 ; port LVDS_UART_AB.RX4_N
NetJ1_A18: J5.6 R10.1 ; port LVDS_UART_AB.RX5_P
NetJ1_A19: J5.7 ; port LVDS_UART_AB.RX5_N
NetJ1_A22: J3.3 ; port LVDS_UART_AB.TX1_P
NetJ1_A23: J3.4 ; port LVDS_UART_AB.TX1_N
NetJ1_A26: J3.8 ; port LVDS_UART_AB.TX2_P
NetJ1_A27: J3.9 ; port LVDS_UART_AB.TX2_N
NetJ1_A30: J3.13 ; port LVDS_UART_AB.TX3_P
NetJ1_A31: J3.14 ; port LVDS_UART_AB.TX3_N
NetJ1_A34: J5.3 ; port LVDS_UART_AB.TX4_P
NetJ1_A35: J5.4 ; port LVDS_UART_AB.TX4_N
NetJ1_A38: J5.8 ; port LVDS_UART_AB.TX5_P
NetJ1_A39: J5.9 ; port LVDS_UART_AB.TX5_N
NetJ1_B12: J6.1 R11.1 ; port LVDS_UART_AB.RX6_P
NetJ1_B13: J6.2 ; port LVDS_UART_AB.RX6_N
NetJ1_B16: J6.6 R12.1 ; port LVDS_UART_AB.RX7_P
NetJ1_B17: J6.7 ; port LVDS_UART_AB.RX7_N
NetJ1_B32: J6.3 ; port LVDS_UART_AB.TX6_P
NetJ1_B33: J6.4 ; port LVDS_UART_AB.TX6_N
NetJ1_B36: J6.8 ; port LVDS_UART_AB.TX7_P
NetJ1_B37: J6.9 ; port LVDS_UART_AB.TX7_N
NetJ1_C2: J4.3 ; port LVDS_UART_CD.TX8_P
NetJ1_C3: J4.4 ; port LVDS_UART_CD.TX8_N
NetJ1_C6: J4.1 R13.1 ; port LVDS_UART_CD.RX8_P
NetJ1_C7: J4.2 ; port LVDS_UART_CD.RX8_N
NetJ1_C10: J4.6 R14.1 ; port LVDS_UART_CD.RX9_P
NetJ1_C11: J4.7 ; port LVDS_UART_CD.RX9_N
NetJ1_C14: J4.11 R15.1 ; port LVDS_UART_CD.RX10_P
NetJ1_C15: J4.12 ; port LVDS_UART_CD.RX10_N
NetJ1_C18: J4.8 ; port LVDS_UART_CD.TX9_P
NetJ1_C19: J4.9 ; port LVDS_UART_CD.TX9_N
NetJ1_C22: J4.13 ; port LVDS_UART_CD.TX10_P
NetJ1_C23: J4.14 ; port LVDS_UART_CD.TX10_N

Not connected (* = marked no-connect by the designer): J5 11* 12* 13* 14*; J6 11* 12* 13* 14* 15*

### Library data of the parts
J3-J6 = 181-015-213R561: 15 Position D-Sub, High Density Receptacle, Female Sockets Connector; MF: NorComp Inc.; Availability: Unavailable; Price: None; MP: 181-015-213R561; Package: None; SnapEDA_Link: https://www.snapeda.com/parts/181-015-213R561/NorComp%20Inc./view-part/560830/?ref=snap; Value: *
R5-R8 R10-R15 = Res3: Resistor; Published: 8-Jun-2000; LatestRevisionDate: 29-May-2009; LatestRevisionNote: IPC-7351 Footprint Added.; PackageReference: J1-0603; Publisher: Altium Limited; PackageDescription: Chip Resistor

## Sheet Ext_connections.SchDoc: External Connections
size A; Author: James Thomas; CompanyName: BYUI; DrawnBy: James Thomas; Engineer: James Thomas; Organization: CSEE; DocumentNumber: 10; Revision: 0.0.1; SheetNumber: 10; SheetTotal: 15
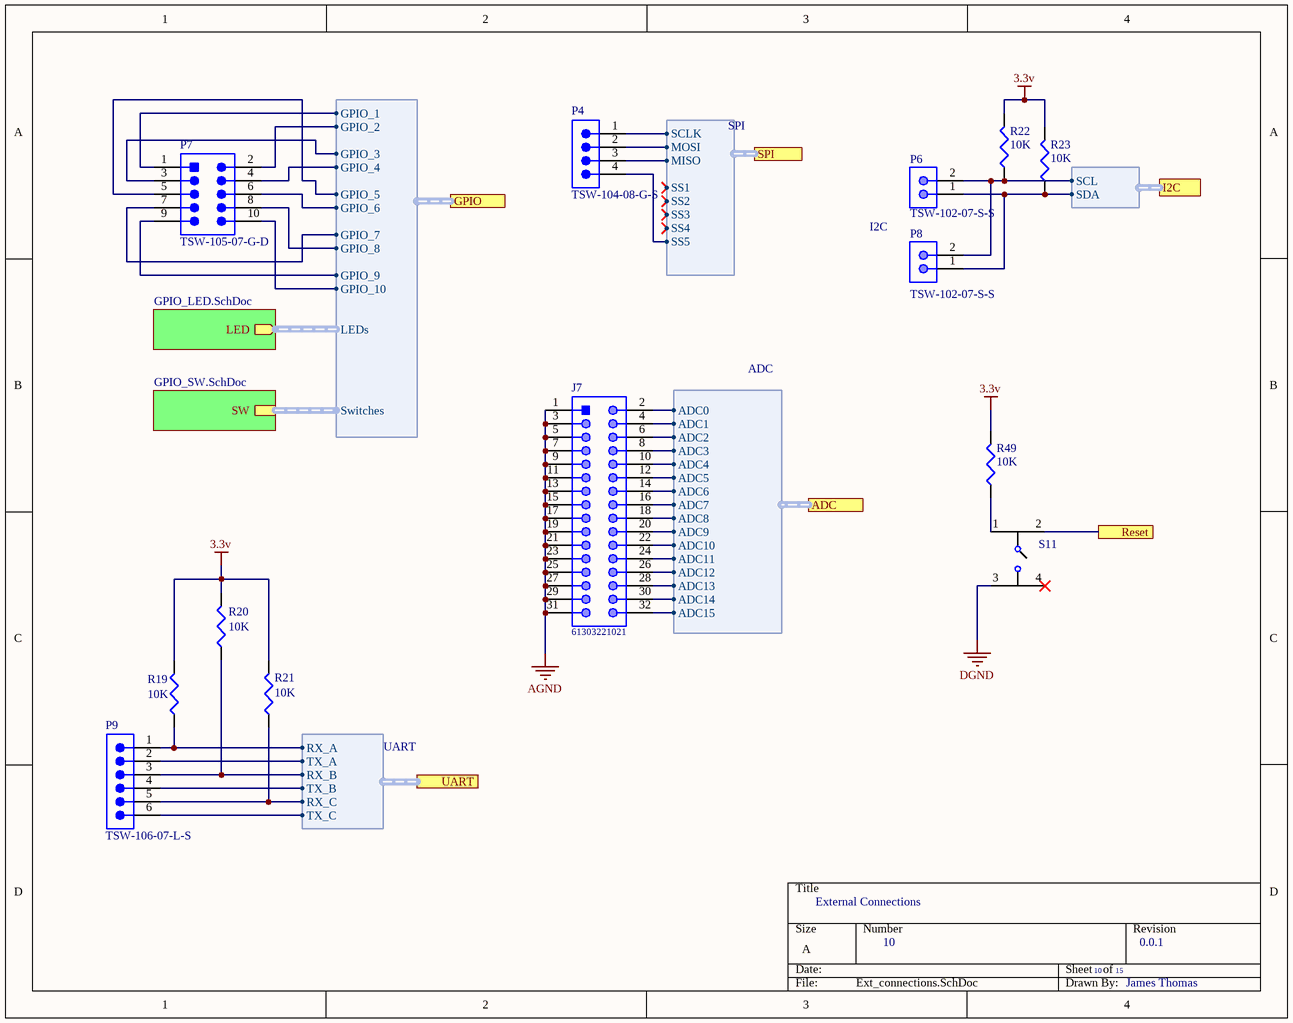
[diagram p8: Ext_connections.SchDoc]

### Parts
J7  61303221021  [61303221021]
P4  TSW-104-08-G-S  [SMTC-TSW-104-08-X-S]
P6  TSW-102-07-S-S  [SMTC-TSW-102-07-S-S]
P7  TSW-105-07-G-D  [SMTC-TSW-105-07-G-D_V]
P8  TSW-102-07-S-S  [SMTC-TSW-102-07-S-S]
P9  TSW-106-07-L-S  [SMTC-TSW-106-07-X-S]
R19  value 10K  [J1-0603]  (hidden comment: Res3)
R20  value 10K  [J1-0603]  (hidden comment: Res3)
R21  value 10K  [J1-0603]  (hidden comment: Res3)
R22  value 10K  [J1-0603]  (hidden comment: Res3)
R23  value 10K  [J1-0603]  (hidden comment: Res3)
R49  value 10K  [J1-0603]  (hidden comment: Res3)
S11  430181038816  [*430181038816]  (value not drawn)

### Sub-sheets
Designator = GPIO_SW.SchDoc: SW (harness SW)
Designator = GPIO_LED.SchDoc: LED (out, harness LED)

### Ports
ADC (harness ADC), GPIO (harness GPIO), I2C (harness I2C), Reset, SPI (harness SPI), UART (harness UART)

### Harnesses
I2C: SCL, SDA
SPI: SCLK, MOSI, MISO, SS5, SS2, SS3, SS1, SS4
UART: RX_A, TX_A, RX_B, TX_B, RX_C, TX_C
GPIO: GPIO_1, GPIO_2, GPIO_3, GPIO_4, GPIO_5, GPIO_6, GPIO_7, GPIO_8, GPIO_9, GPIO_10, LEDs, Switches
ADC: ADC0, ADC1, ADC2, ADC3, ADC4, ADC5, ADC6, ADC7, ADC8, ADC9, ADC10, ADC11, ADC12, ADC13, ADC14, ADC15

### Nets
3.3v: R19.2 R20.2 R21.2 R22.2 R23.2 R49.2
AGND: J7.1 J7.3 J7.5 J7.7 J7.9 J7.11 J7.13 J7.15 J7.17 J7.19 J7.21 J7.23 J7.25 J7.27 J7.29 J7.31
DGND: S11.3
NetJ1_C26: P6.2 P8.2 R22.1 ; port I2C.SCL
NetJ1_C27: P6.1 P8.1 R23.1 ; port I2C.SDA
NetJ1_D8: P4.1 ; port SPI.SCLK
NetJ1_D9: P4.2 ; port SPI.MOSI
NetJ1_D11: P4.3 ; port SPI.MISO
NetJ1_D18: P4.4 ; port SPI.SS5
NetJ1_D20: P9.1 R19.1 ; port UART.RX_A
NetJ1_D21: P9.2 ; port UART.TX_A
NetJ1_D23: P9.3 R20.1 ; port UART.RX_B
NetJ1_D24: P9.4 ; port UART.TX_B
NetJ1_D26: P9.5 R21.1 ; port UART.RX_C
NetJ1_D27: P9.6 ; port UART.TX_C
NetJ1_E6: P7.1 ; port GPIO.GPIO_1
NetJ1_E7: P7.2 ; port GPIO.GPIO_2
NetJ1_E9: P7.3 ; port GPIO.GPIO_3
NetJ1_E10: P7.4 ; port GPIO.GPIO_4
NetJ1_E12: P7.5 ; port GPIO.GPIO_5
NetJ1_E13: P7.6 ; port GPIO.GPIO_6
NetJ1_E15: P7.7 ; port GPIO.GPIO_7
NetJ1_E16: P7.8 ; port GPIO.GPIO_8
NetJ1_E18: P7.9 ; port GPIO.GPIO_9
NetJ1_E19: P7.10 ; port GPIO.GPIO_10
NetJ1_F20: S11.2 ; port Reset
NetJ7_2: J7.2 ; port ADC.ADC0
NetJ7_4: J7.4 ; port ADC.ADC1
NetJ7_6: J7.6 ; port ADC.ADC2
NetJ7_8: J7.8 ; port ADC.ADC3
NetJ7_10: J7.10 ; port ADC.ADC4
NetJ7_12: J7.12 ; port ADC.ADC5
NetJ7_14: J7.14 ; port ADC.ADC6
NetJ7_16: J7.16 ; port ADC.ADC7
NetJ7_18: J7.18 ; port ADC.ADC8
NetJ7_20: J7.20 ; port ADC.ADC9
NetJ7_22: J7.22 ; port ADC.ADC10
NetJ7_24: J7.24 ; port ADC.ADC11
NetJ7_26: J7.26 ; port ADC.ADC12
NetJ7_28: J7.28 ; port ADC.ADC13
NetJ7_30: J7.30 ; port ADC.ADC14
NetJ7_32: J7.32 ; port ADC.ADC15
NetR49_1: R49.1 S11.1

Not connected (* = marked no-connect by the designer): S11 4*

### Notes on the sheet
- I2C

### Library data of the parts
J7 = CMP-1502-01123-1: THT Angled Pin Header WR-PHD, Pitch 2.54 mm, Dual Row, 32 pins; Manufacturer: Wurth Elektronik; Pitch: 2.54mm; Gender: Male; Rated Current: 3A; Withstanding Voltage: 500VAC; Working Voltage: 250VAC; Contact Resistance: 20mOhm; Pin Number: 32; Datasheet URL: https://katalog.we-online.de/em/datasheet/6130xx21021.pdf; Row Number: Dual; Orientation: Angled; Publisher: WurthElektronik; Mounting Technology: THT; Package Reference: 61303221021; Operating Temperature: -40to105degC; Manufacturer URL: http://www.we-online.de; Packaging: Bag; Part Number: 61303221021
P4 = CMP-1024-00357-1: 0.025" SQ Post Header, Through-hole, Vertical, -55 to 125 degC, 2.54 mm Pitch, 4-Pin, Male, RoHS; Manufacturer: Samtec; Pitch: 2.54 mm; RoHS: True; ComponentLink3URL: http://www.samtec.com/documents/webfiles/cpdf/TSW-XXX-XX-XXX-X-XX-XXX-MKT.pdf; Mounting Technology: Through-hole; ComponentLink2URL: http://www.samtec.com/documents/webfiles/pdf/TSW_TH.PDF; ComponentLink1URL: http://www.samtec.com; ComponentLink3Description: Package Specification; PackageVersion: DM, 8/1988; ComponentLink2Description: Datasheet; PackageReference: TSW-104-08-X-S; PackageDescription: .025[0.64] SQ. Post Terminal Strip Assembly; PartNumber: TSW-104-08-G-S; ComponentLink1Description: Manufacturer URL; Temperature Range: -55 to 125 degC; DatasheetVersion: F-214; Orientation: Vertical
P6 P8 = CMP-1681-00004-4: as P5 on sheet FMC_top; ComponentLink1URL: http://www.samtec.com/; Contact Finish: Gold; Mounting Technology: Through Hole; PackageReference: TSW-102-07-S-S; RoHSCompliant: true; Pins: 2; Contact Material: Bronze; ComponentLink2Description: Datasheet; Max Operating Temperature: 125 degC; Min Operating Temperature: -55 degC; Height: 8.38 mm; Packaging: Bulk; ComponentLink1Description: Manufacturer URL; PackageDescription: Male Header, Pitch 2.54 mm, 1 x 2 Position, Height 8.38 mm, Tail Length 2.54 mm; Colour: Black; Contact Plating: Gold; Length: 5.08 mm; ComponentLink2URL: http://suddendocs.samtec.com/catalog_english/tsw_th.pdf; DatasheetVersion: 12/2015; Mount: Through Hole; Lead Pitch: 0.1 inch; REACH SVHC: No SVHC; Package Quantity: 1
P7 = CMP-2000-07330-1: Post Terminal Strip Assembly, Pitch 2.54 mm, 2 x 5 Position, Height 8.58 mm, Tail Length 2.54 mm, -55 to 125 degC, RoHS, Bulk; Manufacturer: Samtec-Inc.; Connector Type: Header,Unshrouded; Number of Positions Loaded: All; Pitch: 0.100"(2.54mm); Number of Positions: 10; Package Reference: TSW-105-07-G-D; Mounting Technology: ThroughHole; Datasheet URL: http://suddendocs.samtec.com/prints/tsw-xxx-xx-xxx-x-xx-xxx-mkt.pdf; Termination: Solder; Packaging: Bulk; Number of Rows: 2; Contact Finish: Gold; Mounting Type: ThroughHole; Features: -; Color: Black; Category: Connectors,Interconnects; Family: RectangularConnectors-Headers,MalePins; Manufacturer URL: http://www.samtec.com/; Series: TSW; Fastening Type: -; Package URL: http://suddendocs.samtec.com/prints/tsw-xxx-xx-x-x-xx-xxx-footprint.pdf; Row Spacing: 0.100"(2.54mm); Contact Mating Length: 0.230"(5.84mm); Contact Finish Thickness: 10µin(0.25µm); Contact Type: MalePin; Package Description: Male Header, Pitch 2.54 mm, 2 x 5 Position, Height 8.58 mm, Tail Length 2.54 mm; Datasheet Version: Rev. DO, 08/1988
P9 = CMP-1024-00386-1: 0.025" SQ Post Header, Through-hole, Vertical, -55 to 125 degC, 2.54 mm Pitch, 6-Pin, Male, RoHS; Manufacturer: Samtec; Pitch: 2.54 mm; RoHS: True; PartNumber: TSW-106-07-L-S; Orientation: Vertical; PackageReference: TSW-106-07-X-S; PackageDescription: .025[0.64] SQ. Post Terminal Strip Assembly; DatasheetVersion: F-214; ComponentLink3Description: Package Specification; Mounting Technology: Through-hole; ComponentLink2Description: Datasheet; PackageVersion: DM, 8/1988; ComponentLink3URL: http://www.samtec.com/documents/webfiles/cpdf/TSW-XXX-XX-XXX-X-XX-XXX-MKT.pdf; Temperature Range: -55 to 125 degC; ComponentLink2URL: http://www.samtec.com/documents/webfiles/pdf/TSW_TH.PDF; ComponentLink1Description: Manufacturer URL; ComponentLink1URL: http://www.samtec.com
R19-R23 R49 = Res3: Resistor; Published: 8-Jun-2000; LatestRevisionDate: 29-May-2009; LatestRevisionNote: IPC-7351 Footprint Added.; PackageReference: J1-0603; Publisher: Altium Limited; PackageDescription: Chip Resistor
S11 = 430181038816: Tactile Switch SPST-NO Top Actuated Surface Mount; MF: Wurth Electronics; Package: None; MP: 430181038816; Price: None; Availability: Unavailable; SnapEDA_Link: https://www.snapeda.com/parts/430181038816/Wurth%20Electronics%20Inc./view-part/523500/?ref=snap; Value: *

## Sheet GPIO_SW.SchDoc: GPIO Switches
size A; Author: James Thomas; CompanyName: BYUI; DrawnBy: James Thomas; Engineer: James Thomas; Organization: CSEE; DocumentNumber: 11; Revision: 0.0.1; SheetNumber: 11; SheetTotal: 15
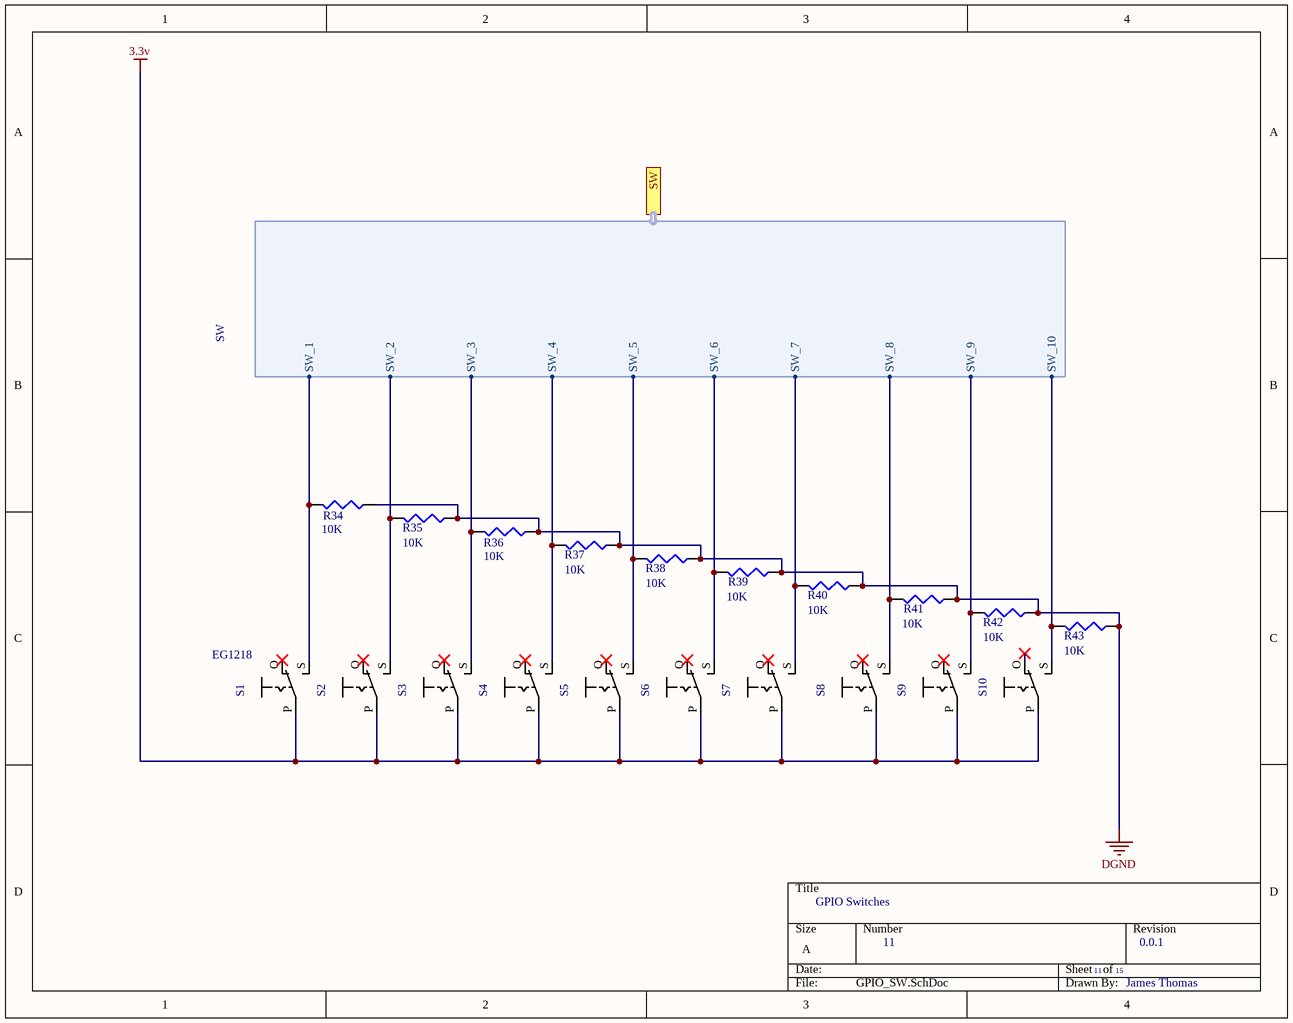
[diagram p9: GPIO_SW.SchDoc]

### Parts
R34  value 10K  [J1-0603]  (hidden comment: Res3)
R35  value 10K  [J1-0603]  (hidden comment: Res3)
R36  value 10K  [J1-0603]  (hidden comment: Res3)
R37  value 10K  [J1-0603]  (hidden comment: Res3)
R38  value 10K  [J1-0603]  (hidden comment: Res3)
R39  value 10K  [J1-0603]  (hidden comment: Res3)
R40  value 10K  [J1-0603]  (hidden comment: Res3)
R41  value 10K  [J1-0603]  (hidden comment: Res3)
R42  value 10K  [J1-0603]  (hidden comment: Res3)
R43  value 10K  [J1-0603]  (hidden comment: Res3)
S1  EG1218  [*EG1218_EG1218(Primary)]
S2  EG1218  [*EG1218_EG1218(Primary)]  (value not drawn)
S3  EG1218  [*EG1218_EG1218(Primary)]  (value not drawn)
S4  EG1218  [*EG1218_EG1218(Primary)]  (value not drawn)
S5  EG1218  [*EG1218_EG1218(Primary)]  (value not drawn)
S6  EG1218  [*EG1218_EG1218(Primary)]  (value not drawn)
S7  EG1218  [*EG1218_EG1218(Primary)]  (value not drawn)
S8  EG1218  [*EG1218_EG1218(Primary)]  (value not drawn)
S9  EG1218  [*EG1218_EG1218(Primary)]  (value not drawn)
S10  EG1218  [*EG1218_EG1218(Primary)]  (value not drawn)

### Ports
SW (harness SW)

### Harnesses
SW: SW_1, SW_2, SW_3, SW_4, SW_5, SW_6, SW_7, SW_8, SW_9, SW_10

### Nets
3.3v: S1.P S2.P S3.P S4.P S5.P S6.P S7.P S8.P S9.P S10.P
DGND: R34.1 R35.1 R36.1 R37.1 R38.1 R39.1 R40.1 R41.1 R42.1 R43.1
NetJ1_F4: R43.2 S10.S ; port SW.SW_10
NetJ1_F5: R42.2 S9.S ; port SW.SW_9
NetJ1_F7: R41.2 S8.S ; port SW.SW_8
NetJ1_F8: R40.2 S7.S ; port SW.SW_7
NetJ1_F10: R39.2 S6.S ; port SW.SW_6
NetJ1_F11: R38.2 S5.S ; port SW.SW_5
NetJ1_F13: R37.2 S4.S ; port SW.SW_4
NetJ1_F14: R36.2 S3.S ; port SW.SW_3
NetJ1_F16: R35.2 S2.S ; port SW.SW_2
NetJ1_F17: R34.2 S1.S ; port SW.SW_1

Not connected (* = marked no-connect by the designer): S1 O*; S2 O*; S3 O*; S4 O*; S5 O*; S6 O*; S7 O*; S8 O*; S9 O*; S10 O*

### Library data of the parts
R34-R43 = Res3: Resistor; Published: 8-Jun-2000; LatestRevisionDate: 29-May-2009; LatestRevisionNote: IPC-7351 Footprint Added.; PackageReference: J1-0603; Publisher: Altium Limited; PackageDescription: Chip Resistor
S1-S10 = EG1218: Slide Switch SPDT Through Hole; MF: E-Switch; Package: FakePackage u; Digi-Key_Part_Number: EG1903-ND; MP: EG1218; SnapEDA_Link: https://www.snapeda.com/parts/EG1218/E-Switch/view-part/13895/?ref=snap; Digi-Key_Purchase_URL: https://www.digikey.com/product-detail/en/e-switch/EG1218/EG1903-ND/101726?utm_source=snapeda&utm_medium=aggregator&utm_campaign=symbol; Value: *

## Sheet GPIO_LED.SchDoc: GPIO LEDs
size A; Author: James Thomas; CompanyName: BYUI; DrawnBy: James Thomas; Engineer: James Thomas; Organization: CSEE; DocumentNumber: 15; Revision: 0.0.1; SheetNumber: 15; SheetTotal: 15
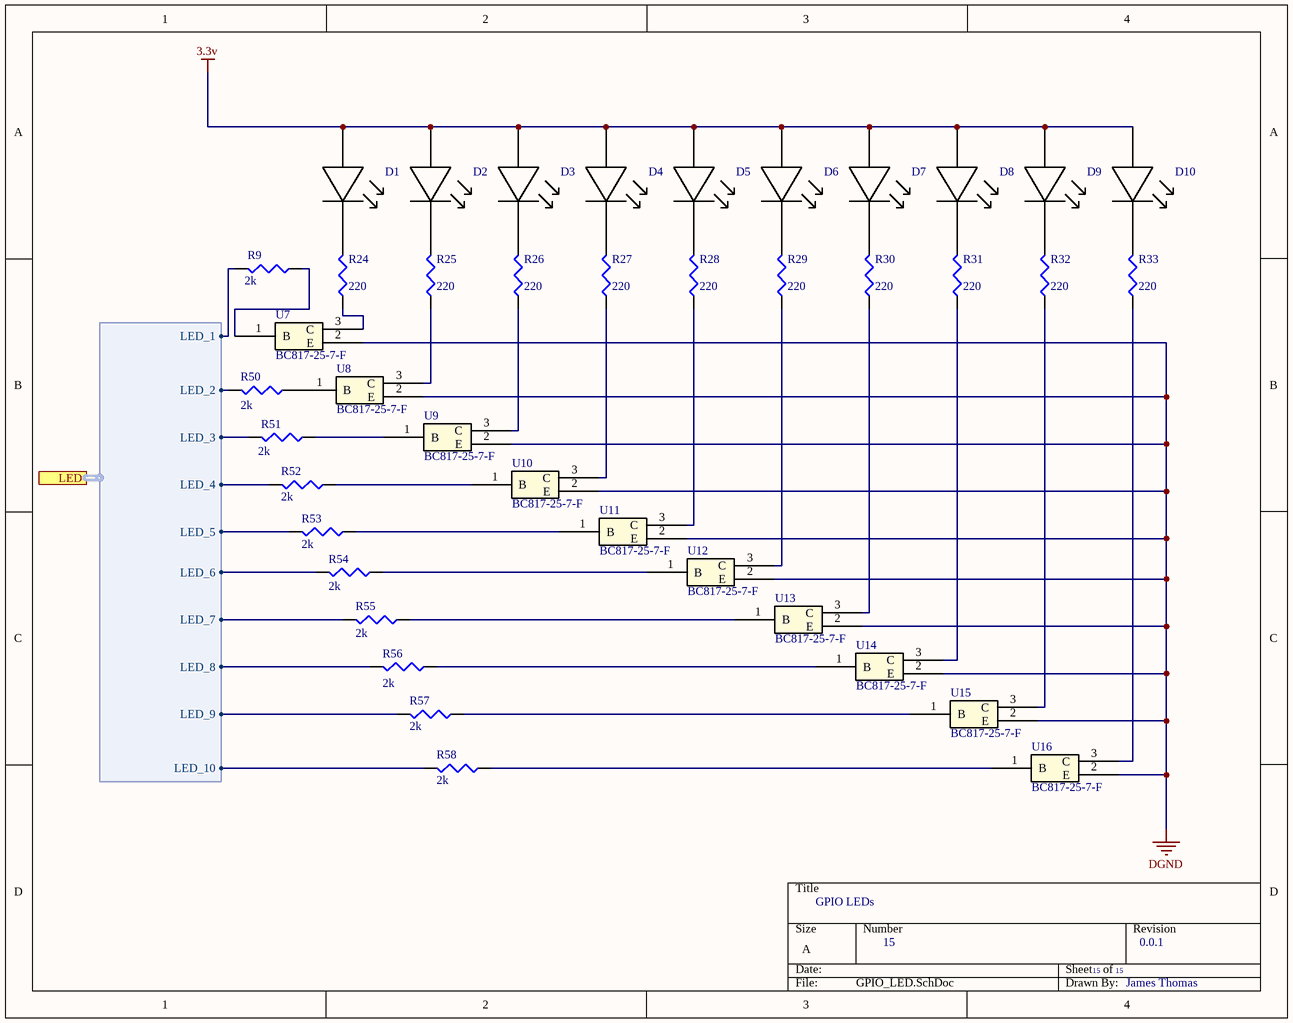
[diagram p10: GPIO_LED.SchDoc]

### Parts
D1  LP T67F-P1R2-35-1-20-R18-Z  [LP T67F-P1R2-35-1-20-R18-Z]  (value not drawn)
D2  LP T67F-P1R2-35-1-20-R18-Z  [LP T67F-P1R2-35-1-20-R18-Z]  (value not drawn)
D3  LP T67F-P1R2-35-1-20-R18-Z  [LP T67F-P1R2-35-1-20-R18-Z]  (value not drawn)
D4  LP T67F-P1R2-35-1-20-R18-Z  [LP T67F-P1R2-35-1-20-R18-Z]  (value not drawn)
D5  LP T67F-P1R2-35-1-20-R18-Z  [LP T67F-P1R2-35-1-20-R18-Z]  (value not drawn)
D6  LP T67F-P1R2-35-1-20-R18-Z  [LP T67F-P1R2-35-1-20-R18-Z]  (value not drawn)
D7  LP T67F-P1R2-35-1-20-R18-Z  [LP T67F-P1R2-35-1-20-R18-Z]  (value not drawn)
D8  LP T67F-P1R2-35-1-20-R18-Z  [LP T67F-P1R2-35-1-20-R18-Z]  (value not drawn)
D9  LP T67F-P1R2-35-1-20-R18-Z  [LP T67F-P1R2-35-1-20-R18-Z]  (value not drawn)
D10  LP T67F-P1R2-35-1-20-R18-Z  [LP T67F-P1R2-35-1-20-R18-Z]  (value not drawn)
R9  value 2k  [J1-0603]  (hidden comment: Res3)
R24  value 220  [J1-0603]  (hidden comment: Res3)
R25  value 220  [J1-0603]  (hidden comment: Res3)
R26  value 220  [J1-0603]  (hidden comment: Res3)
R27  value 220  [J1-0603]  (hidden comment: Res3)
R28  value 220  [J1-0603]  (hidden comment: Res3)
R29  value 220  [J1-0603]  (hidden comment: Res3)
R30  value 220  [J1-0603]  (hidden comment: Res3)
R31  value 220  [J1-0603]  (hidden comment: Res3)
R32  value 220  [J1-0603]  (hidden comment: Res3)
R33  value 220  [J1-0603]  (hidden comment: Res3)
R50  value 2k  [J1-0603]  (hidden comment: Res3)
R51  value 2k  [J1-0603]  (hidden comment: Res3)
R52  value 2k  [J1-0603]  (hidden comment: Res3)
R53  value 2k  [J1-0603]  (hidden comment: Res3)
R54  value 2k  [J1-0603]  (hidden comment: Res3)
R55  value 2k  [J1-0603]  (hidden comment: Res3)
R56  value 2k  [J1-0603]  (hidden comment: Res3)
R57  value 2k  [J1-0603]  (hidden comment: Res3)
R58  value 2k  [J1-0603]  (hidden comment: Res3)
U7  BC817-25-7-F  [*SOT23]
U8  BC817-25-7-F  [*SOT23]
U9  BC817-25-7-F  [*SOT23]
U10  BC817-25-7-F  [*SOT23]
U11  BC817-25-7-F  [*SOT23]
U12  BC817-25-7-F  [*SOT23]
U13  BC817-25-7-F  [*SOT23]
U14  BC817-25-7-F  [*SOT23]
U15  BC817-25-7-F  [*SOT23]
U16  BC817-25-7-F  [*SOT23]

### Ports
LED (harness LED)

### Harnesses
LED: LED_1, LED_2, LED_3, LED_4, LED_5, LED_6, LED_7, LED_8, LED_9, LED_10

### Nets
3.3v: D1.A D2.A D3.A D4.A D5.A D6.A D7.A D8.A D9.A D10.A
DGND: U7.2(E) U8.2(E) U9.2(E) U10.2(E) U11.2(E) U12.2(E) U13.2(E) U14.2(E) U15.2(E) U16.2(E)
NetD1_C: D1.C R24.2
NetD2_C: D2.C R25.2
NetD3_C: D3.C R26.2
NetD4_C: D4.C R27.2
NetD5_C: D5.C R28.2
NetD6_C: D6.C R29.2
NetD7_C: D7.C R30.2
NetD8_C: D8.C R31.2
NetD9_C: D9.C R32.2
NetD10_C: D10.C R33.2
NetJ1_E21: R9.2 ; port LED.LED_1
NetJ1_E22: R50.2 ; port LED.LED_2
NetJ1_E24: R51.2 ; port LED.LED_3
NetJ1_E25: R52.2 ; port LED.LED_4
NetJ1_E27: R53.2 ; port LED.LED_5
NetJ1_E28: R54.2 ; port LED.LED_6
NetJ1_E30: R55.2 ; port LED.LED_7
NetJ1_E31: R56.2 ; port LED.LED_8
NetJ1_E33: R57.2 ; port LED.LED_9
NetJ1_E34: R58.2 ; port LED.LED_10
NetR9_1: R9.1 U7.1(B)
NetR24_1: R24.1 U7.3(C)
NetR25_1: R25.1 U8.3(C)
NetR26_1: R26.1 U9.3(C)
NetR27_1: R27.1 U10.3(C)
NetR28_1: R28.1 U11.3(C)
NetR29_1: R29.1 U12.3(C)
NetR30_1: R30.1 U13.3(C)
NetR31_1: R31.1 U14.3(C)
NetR32_1: R32.1 U15.3(C)
NetR33_1: R33.1 U16.3(C)
NetR50_1: R50.1 U8.1(B)
NetR51_1: R51.1 U9.1(B)
NetR52_1: R52.1 U10.1(B)
NetR53_1: R53.1 U11.1(B)
NetR54_1: R54.1 U12.1(B)
NetR55_1: R55.1 U13.1(B)
NetR56_1: R56.1 U14.1(B)
NetR57_1: R57.1 U15.1(B)
NetR58_1: R58.1 U16.1(B)

### Library data of the parts
D1-D10 = LP T67F-P1R2-35-1-20-R18-Z: SMD LED
R9 R24-R33 R50-R58 = Res3: Resistor; Published: 8-Jun-2000; LatestRevisionDate: 29-May-2009; LatestRevisionNote: IPC-7351 Footprint Added.; PackageReference: J1-0603; Publisher: Altium Limited; PackageDescription: Chip Resistor
U7-U16 = BC817-25-7-F: NPN Transistor; Vendor: Diodes Inc; Built_By: EMA_UL_Team; Manufacturer_Part_Number: BC817-25-7-F; Copyright: Copyright (C) 2018 Accelerated Designs. All rights reserved; RefDes: RefDes; Type: DEV; Value: Value

## Sheet I2C_sensors.SchDoc: I2C Sensors
size A; Author: Sam Bagley; CompanyName: BYUI; DrawnBy: Sam Bagley; Engineer: Sam Bagley; Organization: CSEE; DocumentNumber: 9; Revision: 0.0.1; SheetNumber: 9; SheetTotal: 15
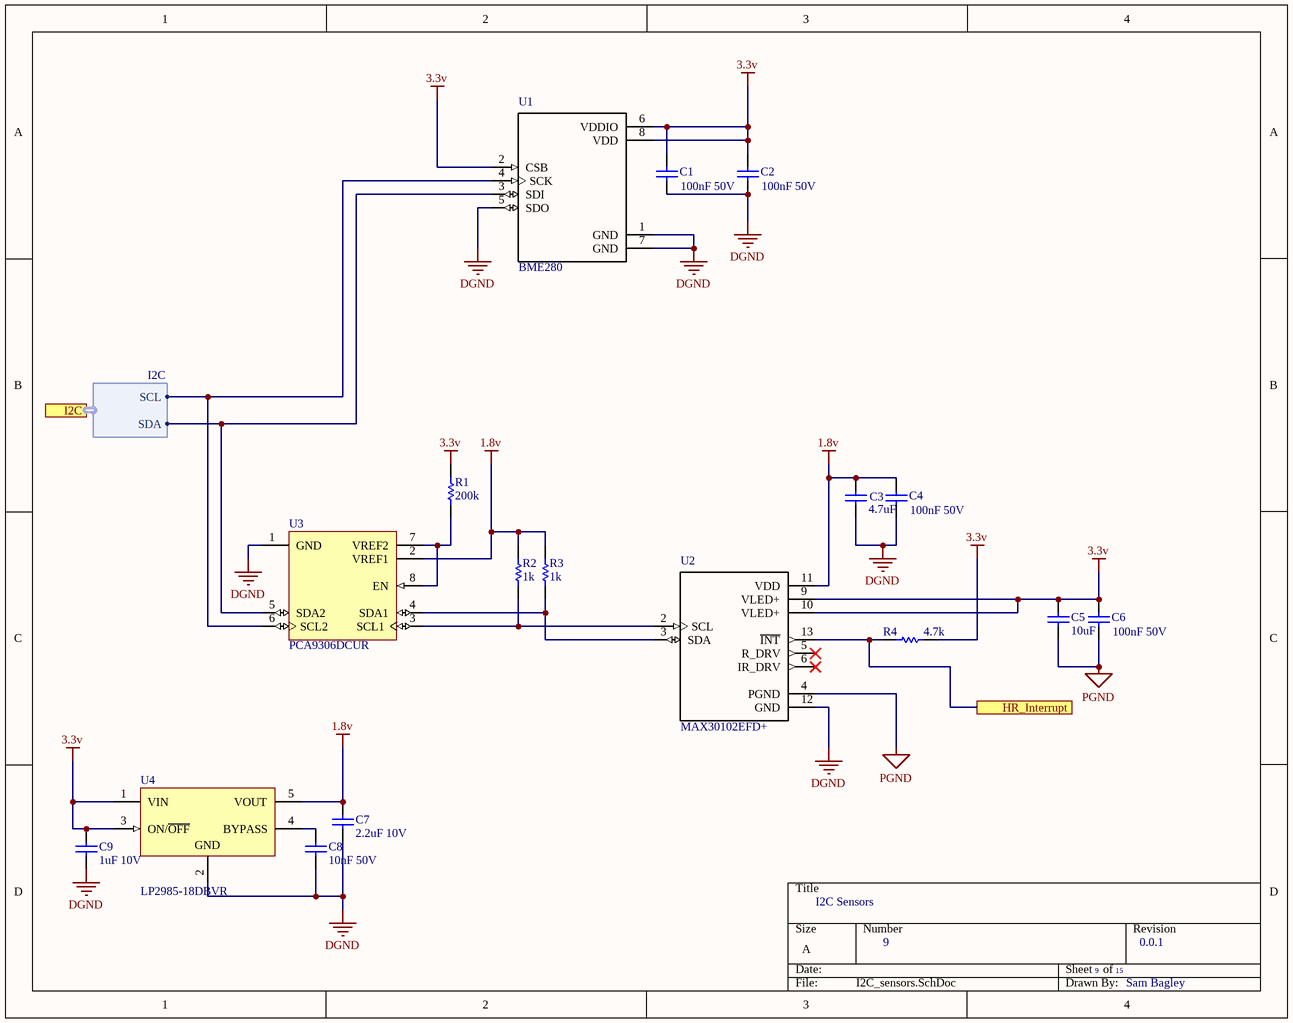
[diagram p11: I2C_sensors.SchDoc]

### Parts
C1  100nF 50V  [CAPC0603(1608)100_M]
C2  100nF 50V  [CAPC0603(1608)100_M]
C3  4.7uF  [CAPC1608X87X35NL15T15]
C4  100nF 50V  [CAPC0603(1608)100_M]
C5  10uF  [CAPC1608X90X20LL10]
C6  100nF 50V  [CAPC0603(1608)100_M]
C7  2.2uF 10V  [CAPC1608X90X35ML10T15]
C8  10nF 50V  [CAPC1608X90X40ML10T20]
C9  1uF 10V  [CAPC1608X90X35ML15T15]
R1  200k  [RESC1608X55X30LL15T15]
R2  1k  [RESC1608X55X30LL20T20]
R3  1k  [RESC1608X55X30LL20T20]
R4  4.7k  [RESC1608X55X30LL15T15]
U1  BME280  [*PSON65P250X250X100-8N]
U2  MAX30102EFD+  [MAX30201]
U3  PCA9306DCUR  [DCU0008A_M]
U4  LP2985-18DBVR  [DBV0005A_M]

### Ports
HR_Interrupt, I2C (harness I2C)

### Harnesses
I2C: SCL, SDA

### Nets
1.8v: C3.2 C4.2 C7.2 R2.2 R3.2 U2.11(VDD) U3.2(VREF1) U4.5(VOUT)
3.3v: C1.2 C2.2 C5.2 C6.2 C9.2 R1.2 R4.2 U1.2(CSB) U1.6(VDDIO) U1.8(VDD) U2.9(VLED+) U2.10(VLED+) U4.1(VIN) U4.3(ON/~{OFF})
DGND: C1.1 C2.1 C3.1 C4.1 C7.1 C8.1 C9.1 U1.1(GND) U1.5(SDO) U1.7(GND) U2.12(GND) U3.1(GND) U4.2(GND)
PGND: C5.1 C6.1 U2.4(PGND)
NetC8_2: C8.2 U4.4(BYPASS)
NetJ1_C26: U1.4(SCK) U3.6(SCL2) ; port I2C.SCL
NetJ1_C27: U1.3(SDI) U3.5(SDA2) ; port I2C.SDA
NetJ1_F37: R4.1 U2.13(~{INT}) ; port HR_Interrupt
NetR1_1: R1.1 U3.7(VREF2) U3.8(EN)
NetR2_1: R2.1 U2.2(SCL) U3.3(SCL1)
NetR3_1: R3.1 U2.3(SDA) U3.4(SDA1)

Not connected (* = marked no-connect by the designer): U2 5(R_DRV)* 6(IR_DRV)*

### Library data of the parts
C1 C2 C4 C6 = CMP-1035-02594-1: CAP 100nF 50V -20% to +80% 0603 (1608 Metric) Thickness 1mm SMD; Case-Metric: 1608; Case-EIA: 0603; Technology: SMT; Rated Voltage: 50 V; Value: 100nF; Max Thickness: 1 mm; Tolerance: -20% to +80%
  C1: ComponentLink1Description: New link; ComponentLink1URL: *
C3 = CMP-2006-03238-1: CAP 4.7uF 0603; Part Number: C0603C475K8PACTU; Manufacturer: Kemet
C5 = CMP-2000-04979-1: Chip Capacitor, 10 uF, +/- 10%, 10 V, -55 to 85 degC, 0603 (1608 Metric), RoHS, Tape and Reel; PCN Part Number: MLCCPartNumberChange30/Nov/2012; Manufacturer: TDK; Manufacturer Part Number: C1608X5R1A106K080AC; Temperature Coefficient: X5R; Product Training Modules: CSeriesGeneralApplicationsSEAT,CCV,andTVCLDesignToolsGuidetoReplacinganElectrolyticCapacitorwithanMLCC; Online Catalog: CSeries,GeneralPurpose; Voltage - Rated: 10V; Other Names: 445-7486-1; Design Resources: 20WNon-IsolatedBuckLEDDriverUsingPLLNK460KG; Kits: 445-9003-KIT-ND-KITCAPCERHICAPMLCCSMD; Height - Seated (Max): -; Family: CeramicCapacitors; Package Description: 2-Pin Surface Mount Device, Body 1.6 x 0.8 mm; Category: Capacitors; Datasheet Version: Mar-15; RoHS Information: RoHSCertificate-MLCC; Thickness (Max): 0.035"(0.90mm); Operating Temperature: -55degC~85degC; Package Reference: 603; Series: C; Applications: GeneralPurpose; Datasheet URL: http://download.siliconexpert.com/pdfs/2015/4/21/15/54/45/779/tdk_/manual/37024850441143360mlcc_commercial_general_en.pdf; Features: -; Lead Style: -; Lead Spacing: -; Ratings: -; Size / Dimension: 0.063"Lx0.031"W(1.60mmx0.80mm); Tolerance: ±10%; Mounting Type: SurfaceMount,MLCC; Standard Package: 1; Package / Case: 0603(1608Metric); Manufacturer URL: http://www.tdk.com/; Packaging: CutTape(CT); Supplier 1: Digi-Key
C7 = CMP-2006-02836-1: CAP CER 2.2uF 10V 0603; Manufacturer: Murata; Part Number: GRM188R71A225KE15D
C8 = CMP-2100-03600-1: Chip Capacitor, 10 nF, +/- 10%, 50 V, -55 to 125 degC, 0603 (1608 Metric), RoHS, Tape and Reel; Manufacturer: Yageo; Insulation Resistance: 100GR; Dielectric: X7R; Material: Ceramic; Lead Free: LeadFree; Case/Package: 0603; Datasheet Version: Rev. 15, 10/2016; Composition: Ceramic; Radiation Hardening: No; Thickness: 0.035inch; RoHSCompliant: True; Voltage Rating (DC): 50V; Termination: SMD/SMT; Capacitance: 10nF; Manufacturer URL: http://www.yageo.com/; Tolerance: 10%; REACH SVHC: NoSVHC; Voltage: 50V; Max Operating Temperature: 125degC; Case Code (Metric): 1608; Package Quantity: 1; Case Code (Imperial): 0603; Packaging: TapeandReel; Package Reference: 0603; Width: 0.031inch; Datasheet URL: http://www.yageo.com/documents/recent/UPY-GPHC_X7R_6.3V-to-50V_15.pdf; Length: 1.6mm; Min Operating Temperature: -55degC; Number of Pins: 2; Depth: 0.8mm; Mount: SurfaceMount; Height: 0.8mm; Voltage Rating: 50V; Package Description: 2-Pin Surface Mount Device, Body 1.6 x 0.8 mm
C9 = CMP-2006-02287-1: CAP CER 1uF 10V 0603; Manufacturer: Kemet; Part Number: C0603C105K8PAC7867
R1 = CMP-2000-00743-1: Part Number: ERJ-3GEYJ204V; Manufacturer: Panasonic
R2 R3 = CMP-2000-00873-1: Manufacturer: Panasonic; Part Number: ERA3AEB102V
R4 = CMP-2000-00522-1: Part Number: ERJ3EKF4701V; Manufacturer: Panasonic
U1 = BME280: / Humidity Temperature Sensor 0 ~ 100% RH IÂ²C, SPI Â±3% 1s Surface Mount /; MF: Bosch; Availability: Unavailable; Package: LGA-8 Bosch; MP: BME280; SnapEDA_Link: https://www.snapeda.com/parts/BME280/Bosch%20Sensortec/view-part/49769/?ref=snap; Price: None; Value: *
U2 = MAX30102EFD+: / Oximeter/Heart Rate Sensor IÂ²C Output /; MF: Maxim Integrated; Price: None; MP: MAX30102EFD+; SnapEDA_Link: https://www.snapeda.com/parts/MAX30102EFD%2B/Maxim%20Integrated/view-part/397548/?ref=snap; Package: OLGA-14 Maxim; Availability: Unavailable; Value: *
U3 = CMP-0314-00419-2: Dual Bi-Directional I2C-Bus and SMBus Voltage Level-Translator, 0 to 5.5 V, -40 to 85 degC, 8-pin US8 (DCU), Green (RoHS & no Sb/Br); Manufacturer: Texas Instruments; tpd max(ns): 1.5; Function: Voltage Translator; Enable Pin: Yes; Rating: Catalog; SubFamily: I2C Special Function; Max Frequency(kHz): 400; Vcc range(V): 0 to 5.5; No. of Outputs: 2; PackageVersion: revF, Jul-2005; Eco-Plan: Green (RoHS & no Sb/Br); ComponentLink2Description: Package Specification; ComponentLink1URL: http://www.ti.com/general/docs/lit/getliterature.tsp?genericPartNumber=PCA9306&fileType=pdf; DatasheetVersion: SCPS113J; On-Chip Power-on-Reset: No; PackageDescription: 8-Pin Thin Shrink Small Outline Package 0.5 mm Pitch; Code_JEDEC: MO-187-CA; PackageReference: DCU0008A; 5V Tolerant I/O: Yes; Open Drain I/O Type: Yes; Mounting Technology: Surface Mount; fSCLK(Max)(MHz): 400; PartNumber: PCA9306DCUR; ComponentLink1Description: Datasheet; ComponentLink2URL: http://www.ti.com/litv/pdf/mpds050d
U4 = CMP-0758-00065-2: Single Output Low Noise LDO, 150 mA, Fixed 1.8 V Output, 1.5% Tolerance, 2.2 to 16 V Input, Low IQ, 5-Pin SOT-23 (DBV), -40 to 125 degC, Green (RoHS & no Sb/Br), Tape and Reel; Manufacturer: Texas Instruments; Vdo (Typ) (mV): 280; Iout (Max) (A): 0.15; Output Options: Fixed Output; Iq (Typ) (mA): 0.85; Accuracy (%): 1.5; Fixed Output Options (V): 1.8; PackageReference: DBV0005A; DatasheetVersion: SLVS522N; RoHS: TRUE; ComponentLink1URL: http://www.ti.com/; ComponentLink3URL: http://www.ti.com/litv/pdf/mpds018j; ComponentLink3Description: Package Specification; Operating Temperature Range (degC): -40 to 125; Vin (V): 2.2 to 16; ComponentLink2URL: http://www.ti.com/lit/ds/symlink/lp2985-50.pdf; PartNumber: LP2985-18DBVR; Packing: Tape and Reel; Mounting Technology: Surface Mount; PackageDescription: 5-Pin Plastic Small Outline, Body 2.9 x 1.6 mm, Pitch 0.95 mm; ComponentLink2Description: Datasheet; PackageVersion: 4073253-4/L; ComponentLink1Description: Manufacturer URL

## Sheet LCD_Screen.SchDoc: LCD Screen
size A; Author: Michael Ashford; CompanyName: BYUI; DrawnBy: Michael Ashford; Engineer: Michael Ashford; DocumentNumber: 3; Revision: 0.0.1; SheetNumber: 3; SheetTotal: 15
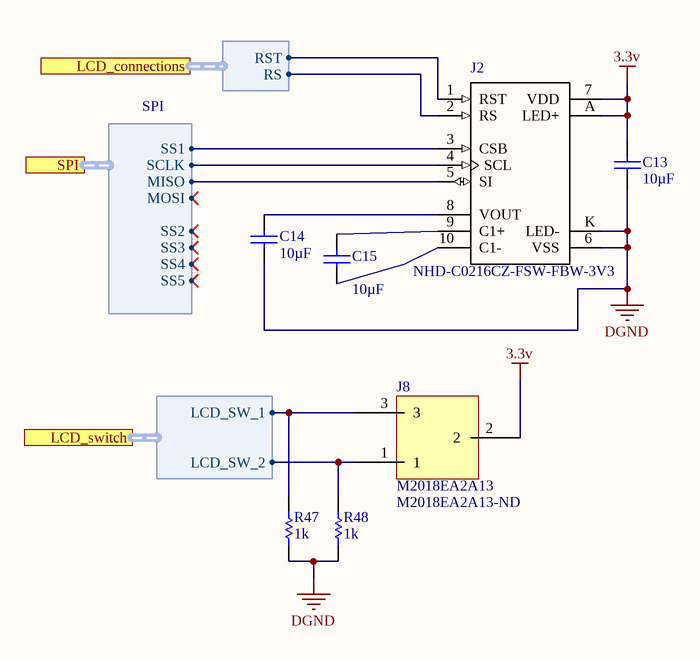
[diagram p12: LCD_Screen.SchDoc]

### Parts
C13  Capacitance: 10µF  [CAPC1608X90X20LL10]  (hidden comment: C1608X5R1A106K080AC)
C14  Capacitance: 10µF  [CAPC1608X90X20LL10]  (hidden comment: C1608X5R1A106K080AC)
C15  Capacitance: 10µF  [CAPC1608X90X20LL10]  (hidden comment: C1608X5R1A106K080AC)
J2  NHD-C0216CZ-FSW-FBW-3V3  [*LCD_NHD-C0216CZ-FSW-FBW-3V3_NHD-C0216CZ-FSW-FBW-3V3(Primary)]
J8  M2018EA2A13  Supplier Part Number 1: M2018EA2A13-ND  [M2018EA2A13]
R47  1k  [RESC1608X55X30LL20T20]
R48  1k  [RESC1608X55X30LL20T20]

### Ports
LCD_connections (harness LCD_connections), LCD_switch (harness LCD_switch), SPI (harness SPI)

### Harnesses
SPI: SCLK, MOSI, MISO, SS1, SS2, SS3, SS4, SS5
LCD_connections: RST, RS
LCD_switch: LCD_SW_1, LCD_SW_2

### Nets
3.3v: C13.2 J2.7(VDD) J2.A(LED+) J8.2
DGND: C13.1 C14.1 J2.6(VSS) J2.K(LED-) R47.1 R48.1
NetC14_2: C14.2 J2.8(VOUT)
NetC15_1: C15.1 J2.10(C1-)
NetC15_2: C15.2 J2.9(C1+)
NetJ1_D8: J2.4(SCL) ; port SPI.SCLK
NetJ1_D11: J2.5(SI) ; port SPI.MISO
NetJ1_D12: J2.3(CSB) ; port SPI.SS1
NetJ1_E2: J2.1(RST) ; port LCD_connections.RST
NetJ1_E3: J2.2(RS) ; port LCD_connections.RS
NetJ1_E36: J8.3 R47.2 ; port SPI.LCD_SW_1
NetJ1_E37: J8.1 R48.2 ; port SPI.LCD_SW_2

### Library data of the parts
C13-C15 = CMP-2000-04979-1: as C17 on sheet FMC_top; Height - Seated (Max): -; Family: CeramicCapacitors; Package Description: 2-Pin Surface Mount Device, Body 1.6 x 0.8 mm; Category: Capacitors; Datasheet Version: Mar-15; RoHS Information: RoHSCertificate-MLCC; Thickness (Max): 0.035"(0.90mm); Operating Temperature: -55degC~85degC; Package Reference: 603; Series: C; Applications: GeneralPurpose; Datasheet URL: http://download.siliconexpert.com/pdfs/2015/4/21/15/54/45/779/tdk_/manual/37024850441143360mlcc_commercial_general_en.pdf; Features: -; Lead Style: -; Lead Spacing: -; Ratings: -; Size / Dimension: 0.063"Lx0.031"W(1.60mmx0.80mm); Tolerance: ±10%; Mounting Type: SurfaceMount,MLCC; Standard Package: 1; Package / Case: 0603(1608Metric); Manufacturer URL: http://www.tdk.com/; Packaging: CutTape(CT); Manufacturer Part Number: C1608X5R1A106K080AC
J2 = NHD-C0216CZ-FSW-FBW-3V3: Character LCD Display Module Transflective 5 x 8 Dots FSTN - Film Super-Twisted Nematic LED - White Serial 41.40mm x 24.30mm x 4.00mm; MF: Newhaven Display; Package: None; Digi-Key_Part_Number: NHD-C0216CZ-FSW-FBW-3V3-ND; MP: NHD-C0216CZ-FSW-FBW-3V3; SnapEDA_Link: https://www.snapeda.com/parts/NHD-C0216CZ-FSW-FBW-3V3/Newhaven%20Display%20Intl/view-part/217645/?ref=snap; Digi-Key_Purchase_URL: https://www.digikey.com/product-detail/en/newhaven-display-intl/NHD-C0216CZ-FSW-FBW-3V3/NHD-C0216CZ-FSW-FBW-3V3-ND/2059234?utm_source=snapeda&utm_medium=aggregator&utm_campaign=symbol; Value: *
J8 = M2018EA2A13: SWITCH TOGGLE SPDT 6A 125V; Manufacturer: NKK Switches; Mechanical Life: 50000Cycles; Actuator Material: Brass,Chrome; Voltage Rating (DC): 30V; Current Rating: 3A; Max Voltage Rating (AC): 250V; Contact Resistance: 20mR; Illumination Type: Non-Illuminated; Electrical Life: 25000Cycles; Switch Function: Mom-Off-Mom; Actuator Length: 13.21mm; Supplier 1: Digi-Key; Manufacturer Part Number: M2018EA2A13; RoHS: Yes; Category: Toggle Switches; Stock 1: 87; Pricing 1: 1=7.80000, 10=7.41000, 25=7.21520, 50=7.02000, 100=6.82500, 250=6.43500, 500=5.46000, 1000=5.16750 (USD); Mount: Through Hole,Brackets; Contact Plating: Gold; Contact Material: Silver; Min Operating Temperature: -30°C; Max Operating Temperature: 85°C; Throw Configuration: SPDT; Package Quantity: 1; Voltage Rating (AC): 125V; Termination: PC Pin; Packaging: Bulk; Max Voltage Rating (DC): 30V; Life (Cycles): 50000Cycles; Orientation: Straight; Lead Free: Lead Free; ComponentLink1URL: https://datasheet.ciiva.com/2907/mtogglesbracketpc-2907069.pdf?src-supplier=Digi-Key; ComponentLink1Description: https://datasheet.ciiva.com/2907/mtogglesbracketpc-2907069.pdf?src-supplier=Digi-Key
R47 R48 = CMP-2000-00873-1: as R2 on sheet I2C_sensors